# EAGLE schematic nodeTestPanel (EAGLE 9.0.1)

## Sheet 1 of 2
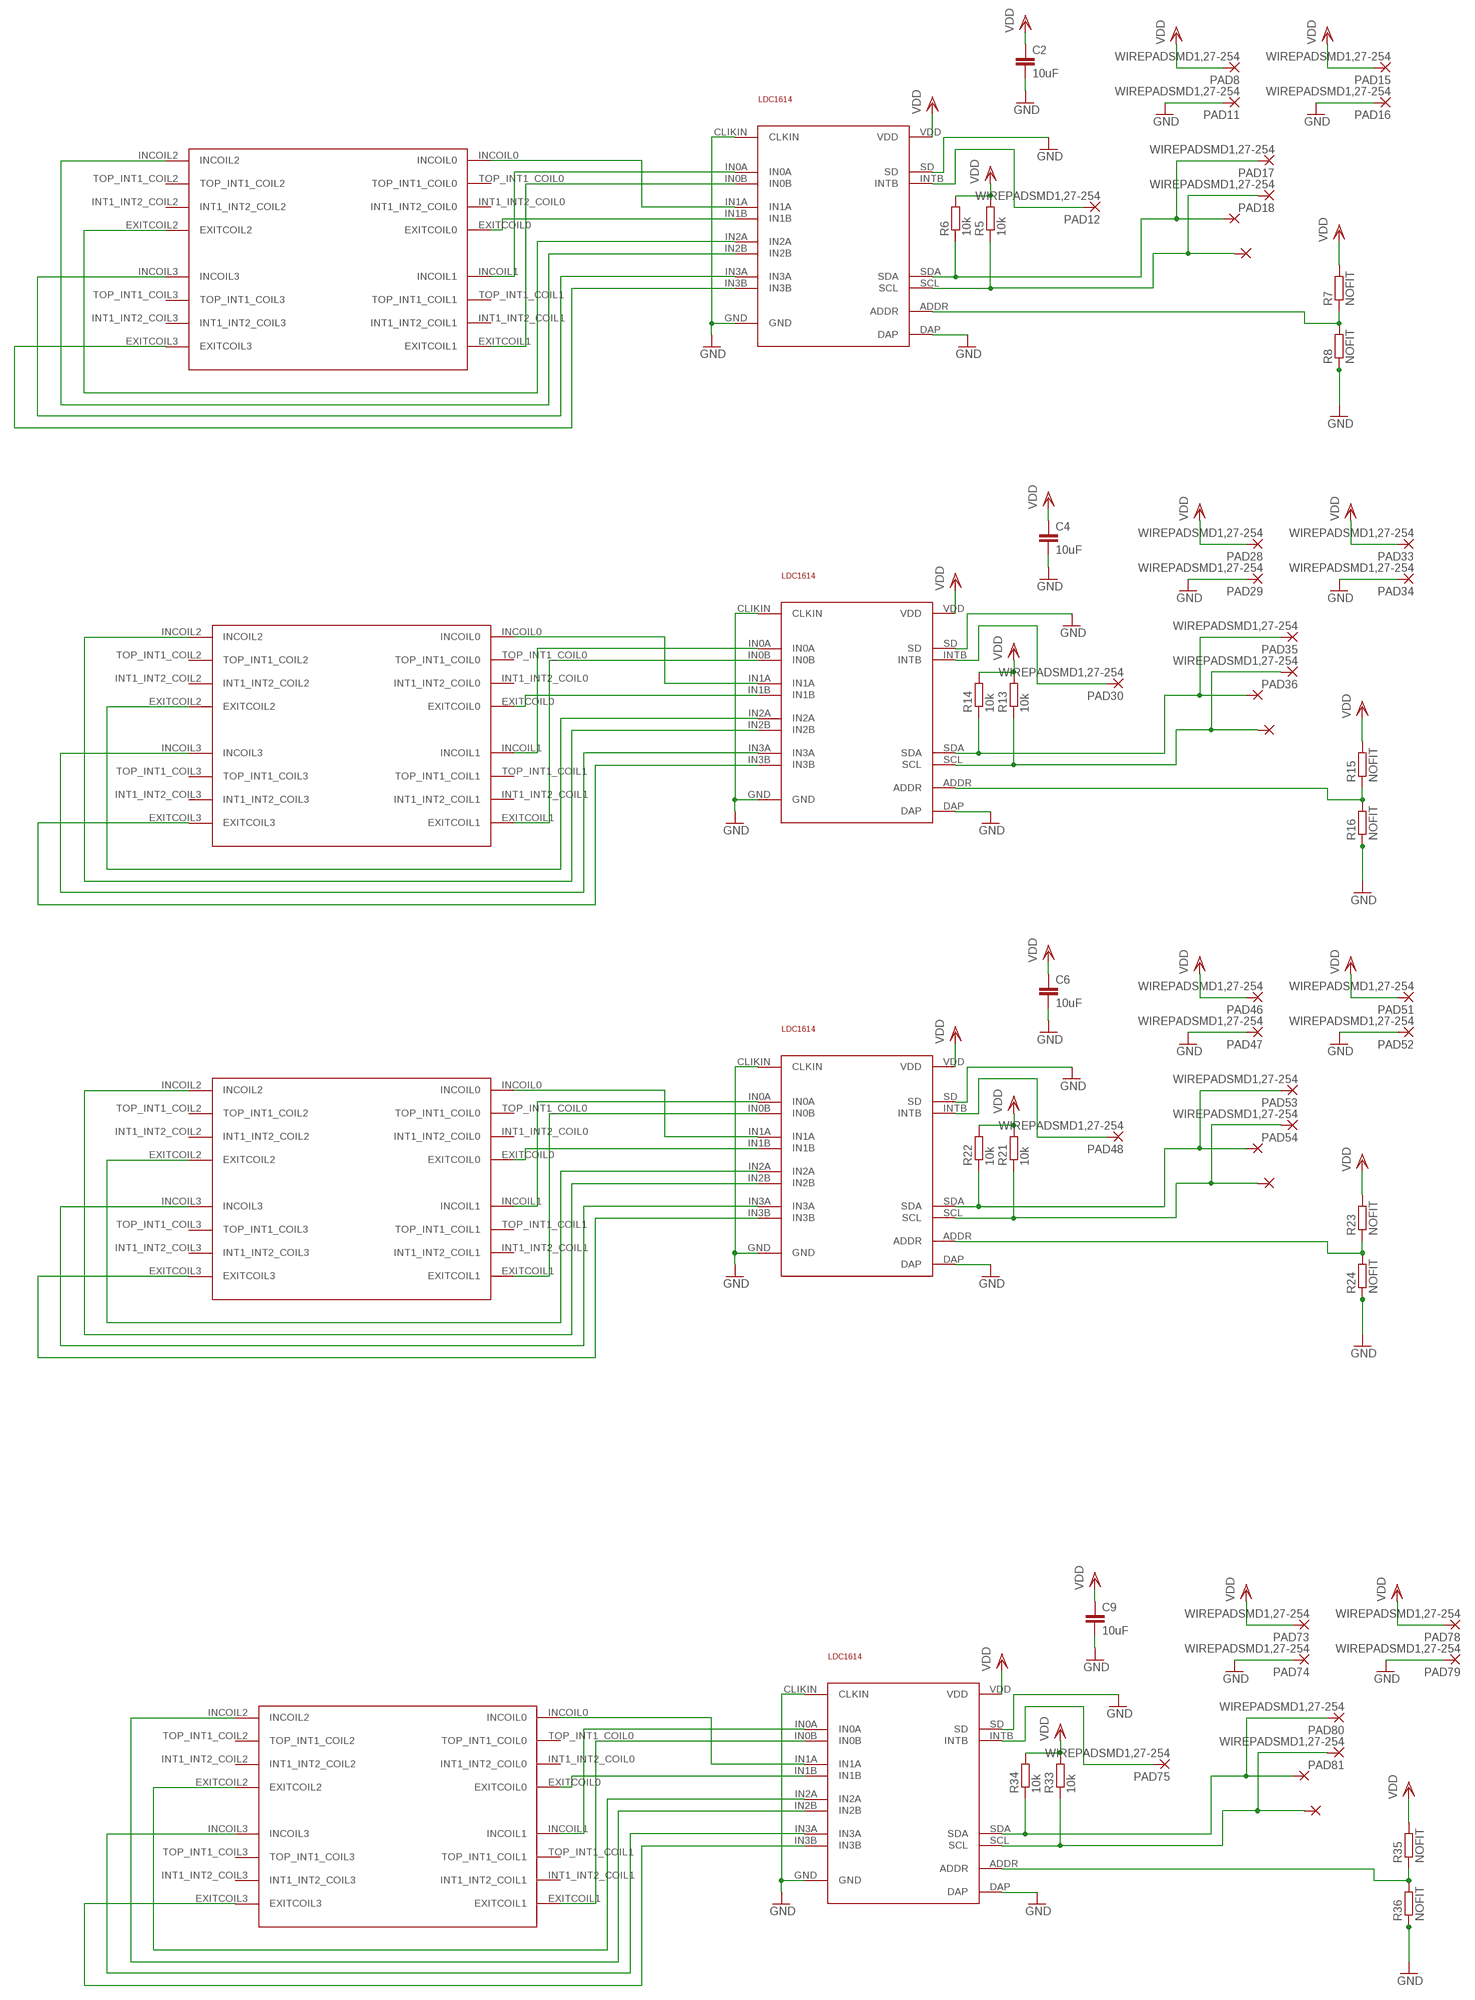
[diagram p0: schematic, sheet 1, part 1 of 3]
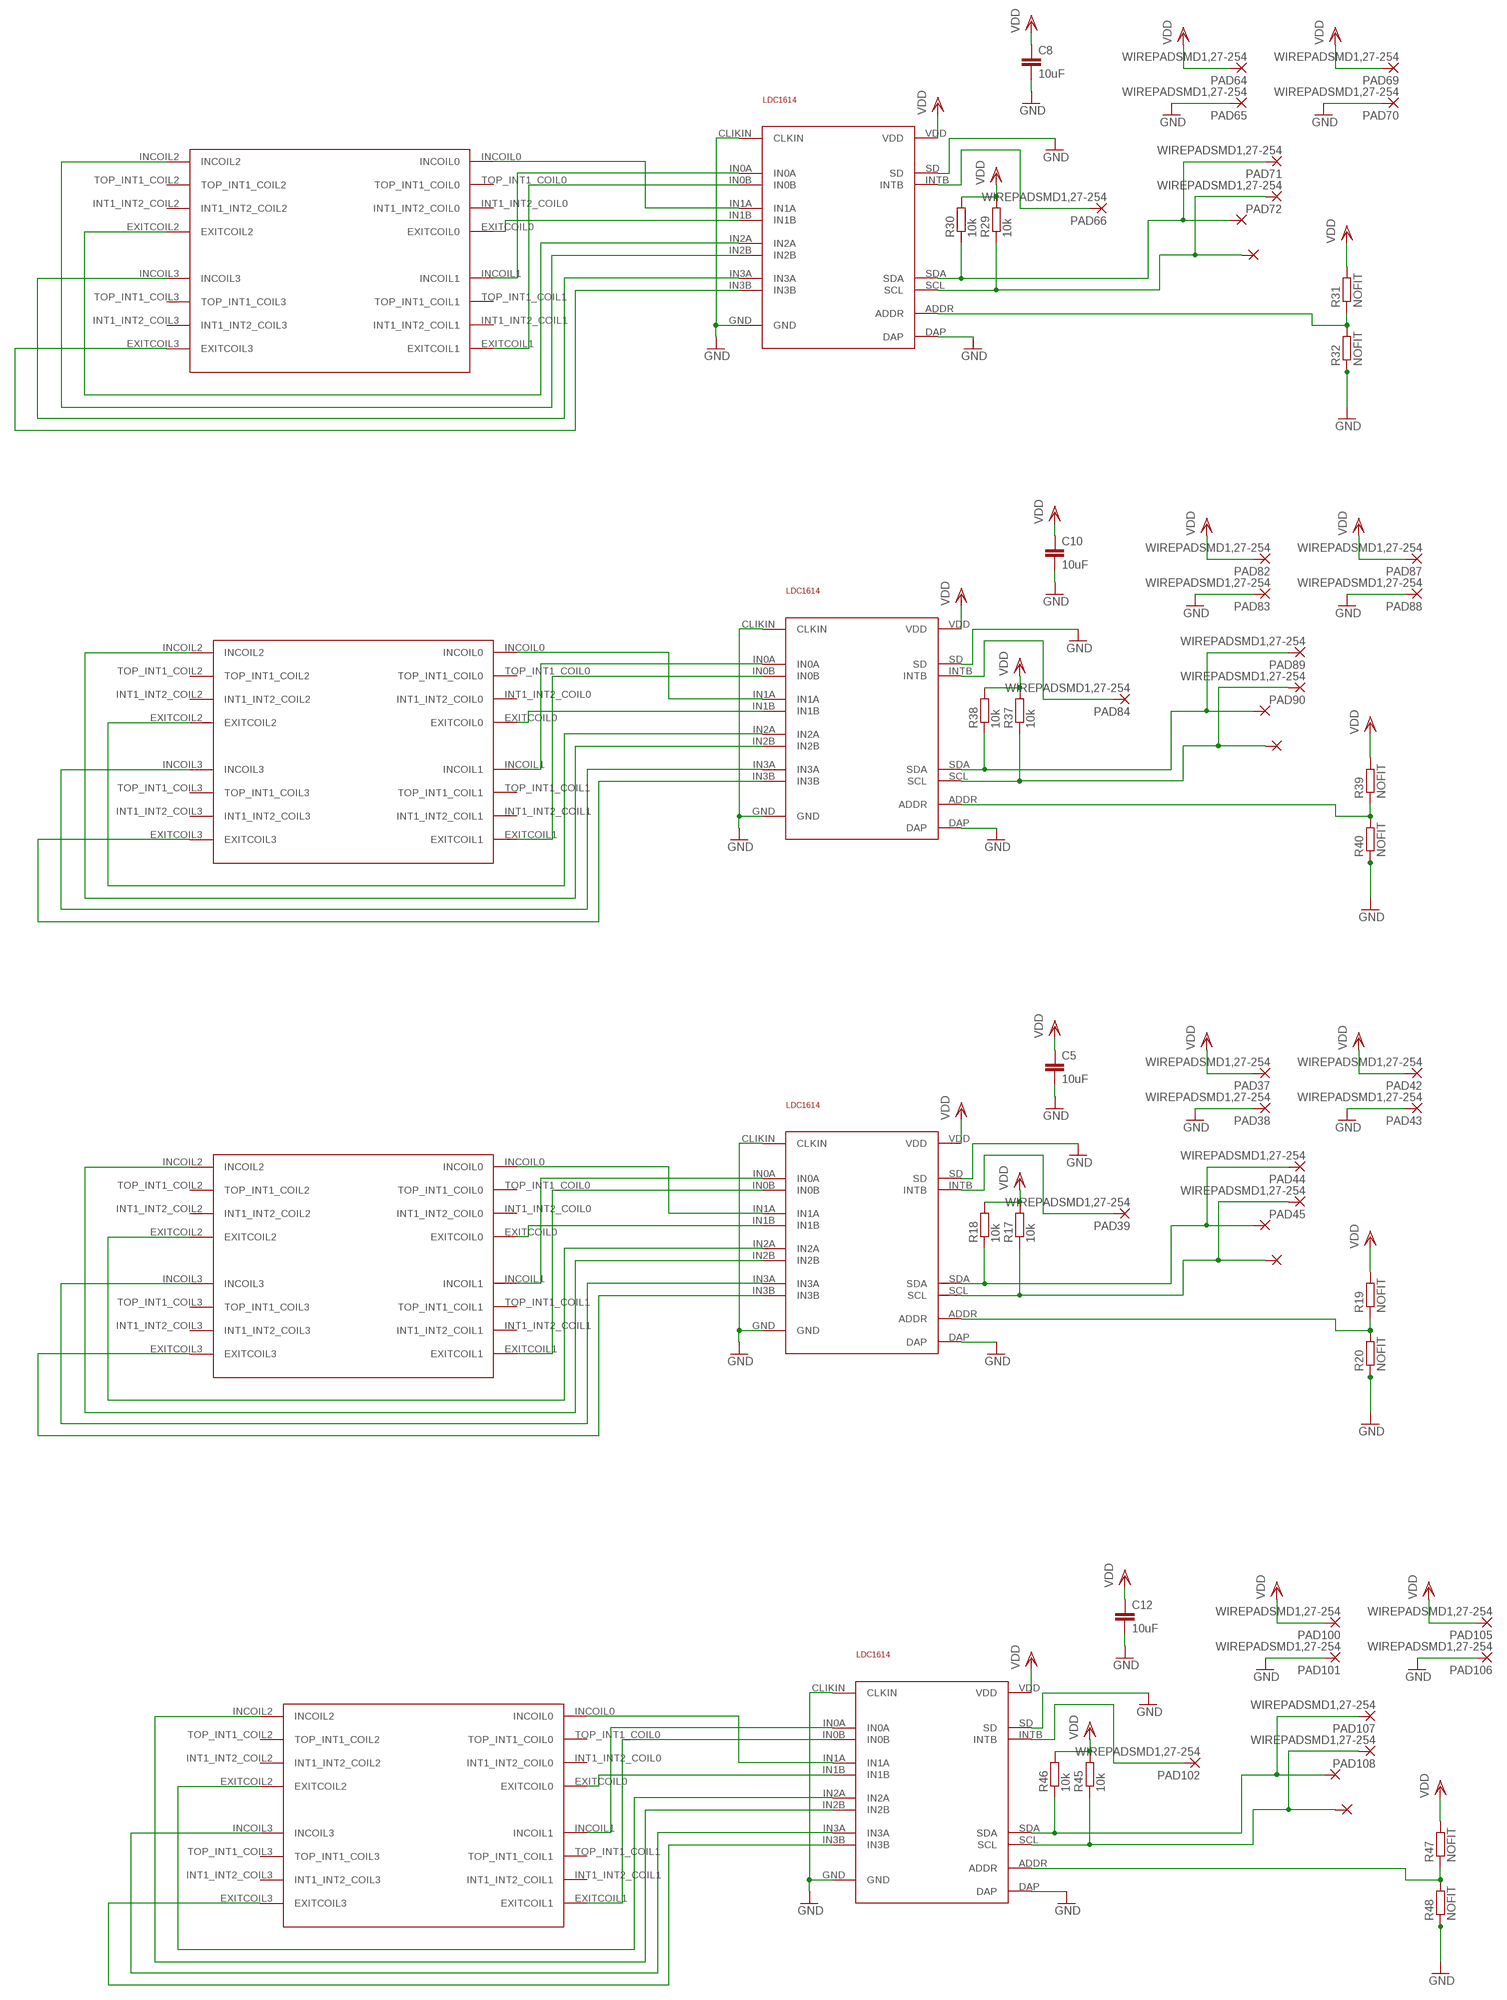
[diagram p1: schematic, sheet 1, part 2 of 3]
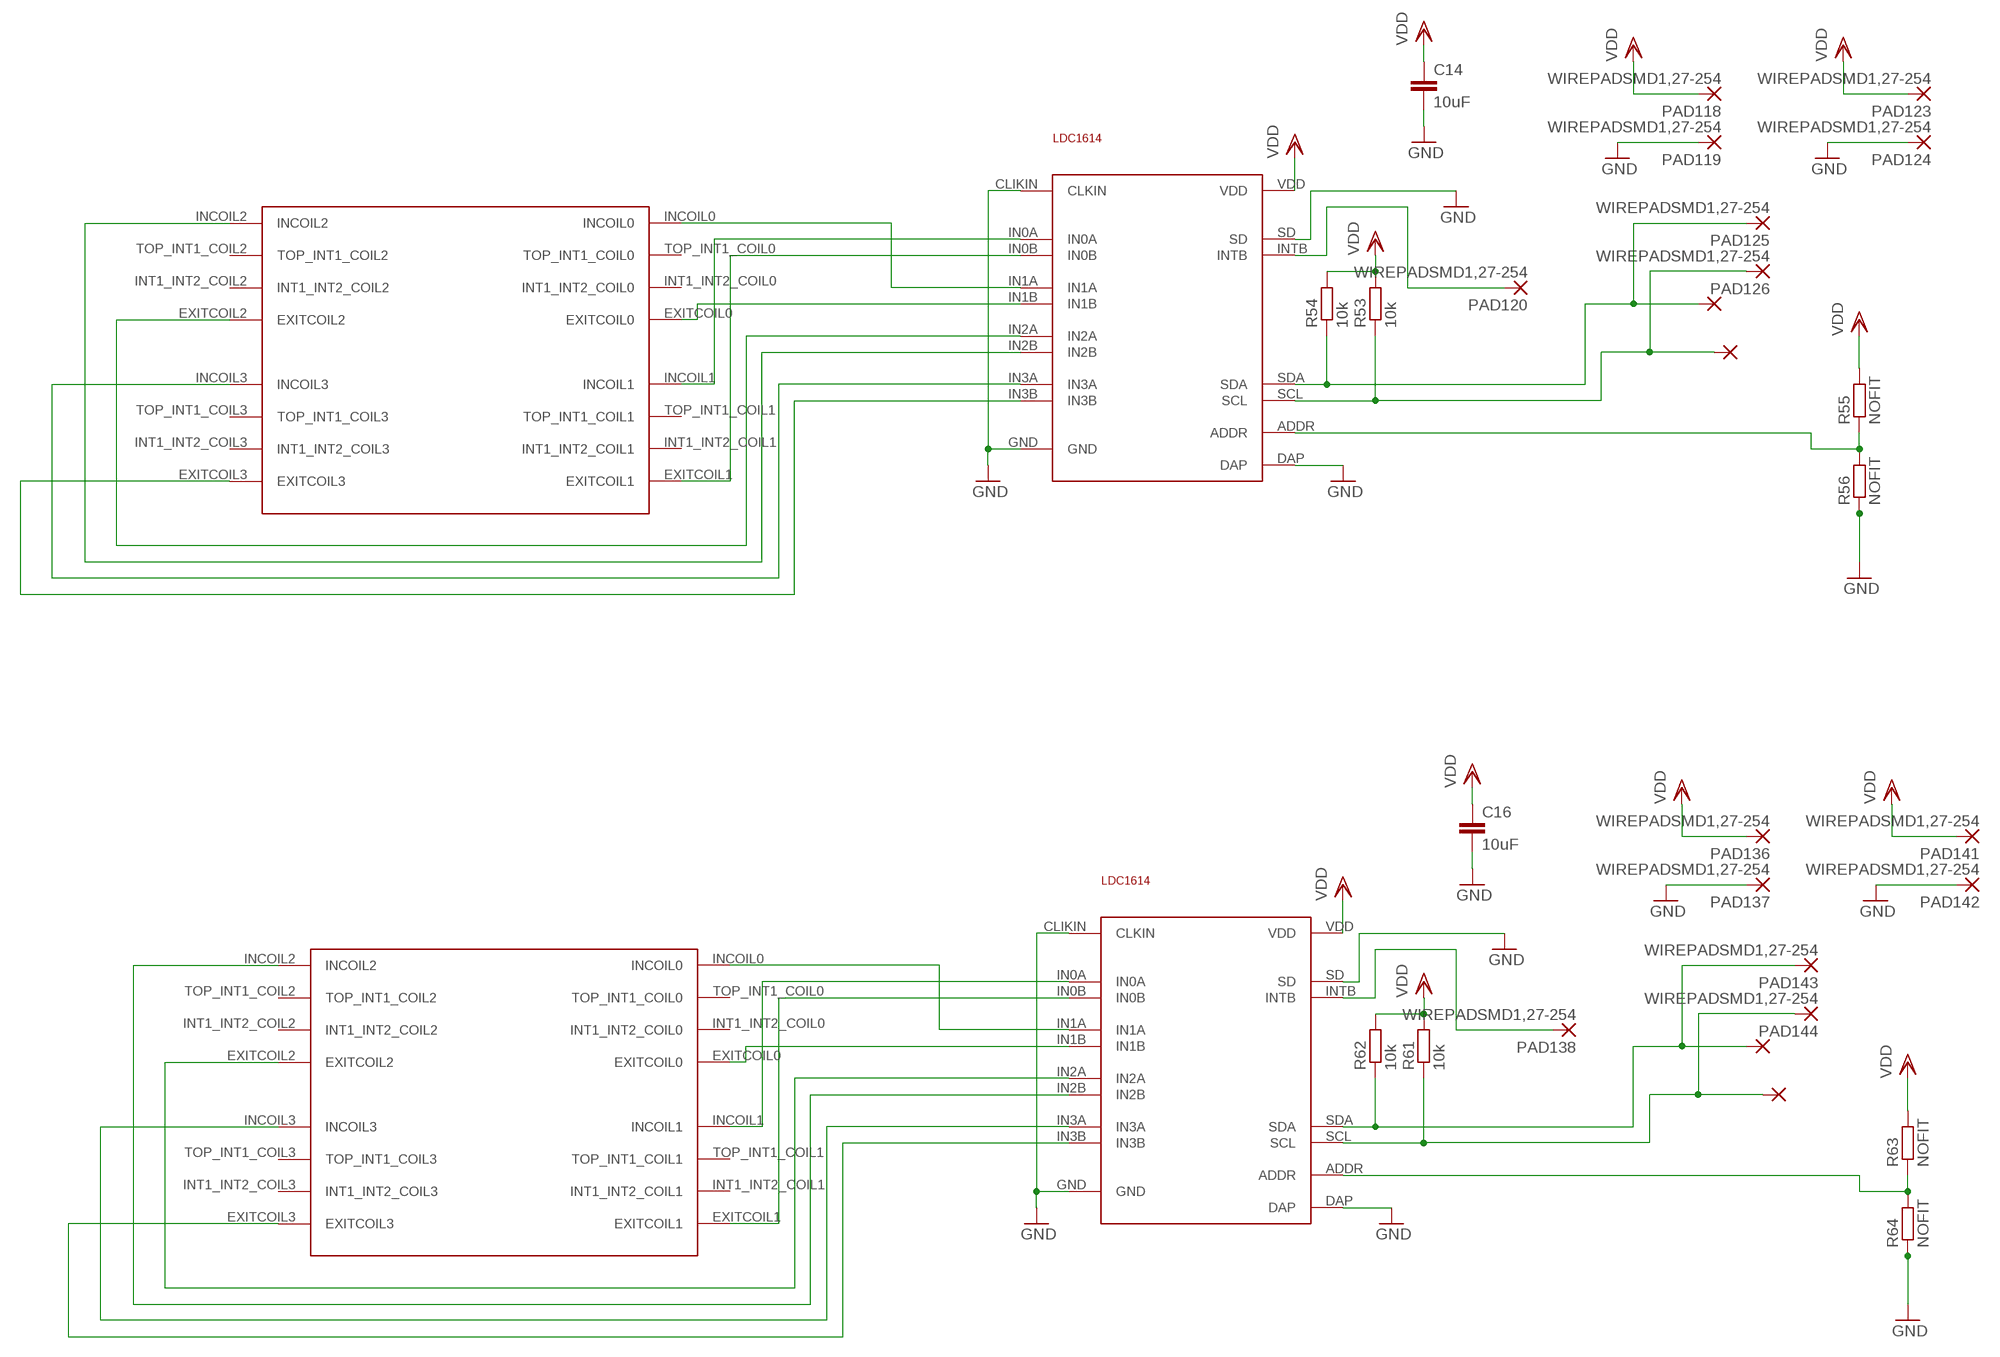
[diagram p2: schematic, sheet 1, part 3 of 3]

### Parts
C2  10uF  C-EUC0402  [C0402]
C4  10uF  C-EUC0402  [C0402]
C5  10uF  C-EUC0402  [C0402]
C6  10uF  C-EUC0402  [C0402]
C8  10uF  C-EUC0402  [C0402]
C9  10uF  C-EUC0402  [C0402]
C10  10uF  C-EUC0402  [C0402]
C12  10uF  C-EUC0402  [C0402]
C14  10uF  C-EUC0402  [C0402]
C16  10uF  C-EUC0402  [C0402]
PAD8  WIREPADSMD1,27-254  [SMD1,27-2,54]
PAD11  WIREPADSMD1,27-254  [SMD1,27-2,54]
PAD12  WIREPADSMD1,27-254  [SMD1,27-2,54]
PAD13  WIREPADSMD1,27-254  [SMD1,27-2,54]
PAD14  WIREPADSMD1,27-254  [SMD1,27-2,54]
PAD15  WIREPADSMD1,27-254  [SMD1,27-2,54]
PAD16  WIREPADSMD1,27-254  [SMD1,27-2,54]
PAD17  WIREPADSMD1,27-254  [SMD1,27-2,54]
PAD18  WIREPADSMD1,27-254  [SMD1,27-2,54]
PAD28  WIREPADSMD1,27-254  [SMD1,27-2,54]
PAD29  WIREPADSMD1,27-254  [SMD1,27-2,54]
PAD30  WIREPADSMD1,27-254  [SMD1,27-2,54]
PAD31  WIREPADSMD1,27-254  [SMD1,27-2,54]
PAD32  WIREPADSMD1,27-254  [SMD1,27-2,54]
PAD33  WIREPADSMD1,27-254  [SMD1,27-2,54]
PAD34  WIREPADSMD1,27-254  [SMD1,27-2,54]
PAD35  WIREPADSMD1,27-254  [SMD1,27-2,54]
PAD36  WIREPADSMD1,27-254  [SMD1,27-2,54]
PAD37  WIREPADSMD1,27-254  [SMD1,27-2,54]
PAD38  WIREPADSMD1,27-254  [SMD1,27-2,54]
PAD39  WIREPADSMD1,27-254  [SMD1,27-2,54]
PAD40  WIREPADSMD1,27-254  [SMD1,27-2,54]
PAD41  WIREPADSMD1,27-254  [SMD1,27-2,54]
PAD42  WIREPADSMD1,27-254  [SMD1,27-2,54]
PAD43  WIREPADSMD1,27-254  [SMD1,27-2,54]
PAD44  WIREPADSMD1,27-254  [SMD1,27-2,54]
PAD45  WIREPADSMD1,27-254  [SMD1,27-2,54]
PAD46  WIREPADSMD1,27-254  [SMD1,27-2,54]
PAD47  WIREPADSMD1,27-254  [SMD1,27-2,54]
PAD48  WIREPADSMD1,27-254  [SMD1,27-2,54]
PAD49  WIREPADSMD1,27-254  [SMD1,27-2,54]
PAD50  WIREPADSMD1,27-254  [SMD1,27-2,54]
PAD51  WIREPADSMD1,27-254  [SMD1,27-2,54]
PAD52  WIREPADSMD1,27-254  [SMD1,27-2,54]
PAD53  WIREPADSMD1,27-254  [SMD1,27-2,54]
PAD54  WIREPADSMD1,27-254  [SMD1,27-2,54]
PAD64  WIREPADSMD1,27-254  [SMD1,27-2,54]
PAD65  WIREPADSMD1,27-254  [SMD1,27-2,54]
PAD66  WIREPADSMD1,27-254  [SMD1,27-2,54]
PAD67  WIREPADSMD1,27-254  [SMD1,27-2,54]
PAD68  WIREPADSMD1,27-254  [SMD1,27-2,54]
PAD69  WIREPADSMD1,27-254  [SMD1,27-2,54]
PAD70  WIREPADSMD1,27-254  [SMD1,27-2,54]
PAD71  WIREPADSMD1,27-254  [SMD1,27-2,54]
PAD72  WIREPADSMD1,27-254  [SMD1,27-2,54]
PAD73  WIREPADSMD1,27-254  [SMD1,27-2,54]
PAD74  WIREPADSMD1,27-254  [SMD1,27-2,54]
PAD75  WIREPADSMD1,27-254  [SMD1,27-2,54]
PAD76  WIREPADSMD1,27-254  [SMD1,27-2,54]
PAD77  WIREPADSMD1,27-254  [SMD1,27-2,54]
PAD78  WIREPADSMD1,27-254  [SMD1,27-2,54]
PAD79  WIREPADSMD1,27-254  [SMD1,27-2,54]
PAD80  WIREPADSMD1,27-254  [SMD1,27-2,54]
PAD81  WIREPADSMD1,27-254  [SMD1,27-2,54]
PAD82  WIREPADSMD1,27-254  [SMD1,27-2,54]
PAD83  WIREPADSMD1,27-254  [SMD1,27-2,54]
PAD84  WIREPADSMD1,27-254  [SMD1,27-2,54]
PAD85  WIREPADSMD1,27-254  [SMD1,27-2,54]
PAD86  WIREPADSMD1,27-254  [SMD1,27-2,54]
PAD87  WIREPADSMD1,27-254  [SMD1,27-2,54]
PAD88  WIREPADSMD1,27-254  [SMD1,27-2,54]
PAD89  WIREPADSMD1,27-254  [SMD1,27-2,54]
PAD90  WIREPADSMD1,27-254  [SMD1,27-2,54]
PAD100  WIREPADSMD1,27-254  [SMD1,27-2,54]
PAD101  WIREPADSMD1,27-254  [SMD1,27-2,54]
PAD102  WIREPADSMD1,27-254  [SMD1,27-2,54]
PAD103  WIREPADSMD1,27-254  [SMD1,27-2,54]
PAD104  WIREPADSMD1,27-254  [SMD1,27-2,54]
PAD105  WIREPADSMD1,27-254  [SMD1,27-2,54]
PAD106  WIREPADSMD1,27-254  [SMD1,27-2,54]
PAD107  WIREPADSMD1,27-254  [SMD1,27-2,54]
PAD108  WIREPADSMD1,27-254  [SMD1,27-2,54]
PAD118  WIREPADSMD1,27-254  [SMD1,27-2,54]
PAD119  WIREPADSMD1,27-254  [SMD1,27-2,54]
PAD120  WIREPADSMD1,27-254  [SMD1,27-2,54]
PAD121  WIREPADSMD1,27-254  [SMD1,27-2,54]
PAD122  WIREPADSMD1,27-254  [SMD1,27-2,54]
PAD123  WIREPADSMD1,27-254  [SMD1,27-2,54]
PAD124  WIREPADSMD1,27-254  [SMD1,27-2,54]
PAD125  WIREPADSMD1,27-254  [SMD1,27-2,54]
PAD126  WIREPADSMD1,27-254  [SMD1,27-2,54]
PAD136  WIREPADSMD1,27-254  [SMD1,27-2,54]
PAD137  WIREPADSMD1,27-254  [SMD1,27-2,54]
PAD138  WIREPADSMD1,27-254  [SMD1,27-2,54]
PAD139  WIREPADSMD1,27-254  [SMD1,27-2,54]
PAD140  WIREPADSMD1,27-254  [SMD1,27-2,54]
PAD141  WIREPADSMD1,27-254  [SMD1,27-2,54]
PAD142  WIREPADSMD1,27-254  [SMD1,27-2,54]
PAD143  WIREPADSMD1,27-254  [SMD1,27-2,54]
PAD144  WIREPADSMD1,27-254  [SMD1,27-2,54]
R5  10k  R-EU_R0402  [R0402]
R6  10k  R-EU_R0402  [R0402]
R7  NOFIT  R-EU_R0201  [R0201]
R8  NOFIT  R-EU_R0201  [R0201]
R13  10k  R-EU_R0402  [R0402]
R14  10k  R-EU_R0402  [R0402]
R15  NOFIT  R-EU_R0201  [R0201]
R16  NOFIT  R-EU_R0201  [R0201]
R17  10k  R-EU_R0402  [R0402]
R18  10k  R-EU_R0402  [R0402]
R19  NOFIT  R-EU_R0201  [R0201]
R20  NOFIT  R-EU_R0201  [R0201]
R21  10k  R-EU_R0402  [R0402]
R22  10k  R-EU_R0402  [R0402]
R23  NOFIT  R-EU_R0201  [R0201]
R24  NOFIT  R-EU_R0201  [R0201]
R29  10k  R-EU_R0402  [R0402]
R30  10k  R-EU_R0402  [R0402]
R31  NOFIT  R-EU_R0201  [R0201]
R32  NOFIT  R-EU_R0201  [R0201]
R33  10k  R-EU_R0402  [R0402]
R34  10k  R-EU_R0402  [R0402]
R35  NOFIT  R-EU_R0201  [R0201]
R36  NOFIT  R-EU_R0201  [R0201]
R37  10k  R-EU_R0402  [R0402]
R38  10k  R-EU_R0402  [R0402]
R39  NOFIT  R-EU_R0201  [R0201]
R40  NOFIT  R-EU_R0201  [R0201]
R45  10k  R-EU_R0402  [R0402]
R46  10k  R-EU_R0402  [R0402]
R47  NOFIT  R-EU_R0201  [R0201]
R48  NOFIT  R-EU_R0201  [R0201]
R53  10k  R-EU_R0402  [R0402]
R54  10k  R-EU_R0402  [R0402]
R55  NOFIT  R-EU_R0201  [R0201]
R56  NOFIT  R-EU_R0201  [R0201]
R61  10k  R-EU_R0402  [R0402]
R62  10k  R-EU_R0402  [R0402]
R63  NOFIT  R-EU_R0201  [R0201]
R64  NOFIT  R-EU_R0201  [R0201]
U2  LDC1614  [WQFN-16]
U4  LDC1614  [WQFN-16]
U5  LDC1614  [WQFN-16]
U6  LDC1614  [WQFN-16]
U8  LDC1614  [WQFN-16]
U9  LDC1614  [WQFN-16]
U10  LDC1614  [WQFN-16]
U12  LDC1614  [WQFN-16]
U14  LDC1614  [WQFN-16]
U16  LDC1614  [WQFN-16]
U$1  FATSQUARE_GROUP  [FAT_SQUARE]
U$4  FATSQUARE_GROUP  [FAT_SQUARE]
U$5  FATSQUARE_GROUP  [FAT_SQUARE]
U$6  FATSQUARE_GROUP  [FAT_SQUARE]
U$8  FATSQUARE_GROUP  [FAT_SQUARE]
U$9  FATSQUARE_GROUP  [FAT_SQUARE]
U$10  FATSQUARE_GROUP  [FAT_SQUARE]
U$12  FATSQUARE_GROUP  [FAT_SQUARE]
U$14  FATSQUARE_GROUP  [FAT_SQUARE]
U$16  FATSQUARE_GROUP  [FAT_SQUARE]

### Nets
ADDR1: R7.1 R8.2 U2.ADDR
ADDR3: R15.1 R16.2 U4.ADDR
ADDR4: R19.1 R20.2 U5.ADDR
ADDR5: R23.1 R24.2 U6.ADDR
ADDR7: R31.1 R32.2 U8.ADDR
ADDR8: R35.1 R36.2 U9.ADDR
ADDR9: R39.1 R40.2 U10.ADDR
ADDR11: R47.1 R48.2 U12.ADDR
ADDR13: R55.1 R56.2 U14.ADDR
ADDR15: R63.1 R64.2 U16.ADDR
GND: C2.2 C4.2 C5.2 C6.2 C8.2 C9.2 C10.2 C12.2 C14.2 C16.2 PAD11.1(P) PAD16.1(P) PAD29.1(P) PAD34.1(P) PAD38.1(P) PAD43.1(P) PAD47.1(P) PAD52.1(P) PAD65.1(P) PAD70.1(P) PAD74.1(P) PAD79.1(P) PAD83.1(P) PAD88.1(P) PAD101.1(P) PAD106.1(P) PAD119.1(P) PAD124.1(P) PAD137.1(P) PAD142.1(P) R8.1 R16.1 R20.1 R24.1 R32.1 R36.1 R40.1 R48.1 R56.1 R64.1 U2.CLIKIN(CLKIN) U2.DAP U2.GND U2.SD U4.CLIKIN(CLKIN) U4.DAP U4.GND U4.SD U5.CLIKIN(CLKIN) U5.DAP U5.GND U5.SD U6.CLIKIN(CLKIN) U6.DAP U6.GND U6.SD U8.CLIKIN(CLKIN) U8.DAP U8.GND U8.SD U9.CLIKIN(CLKIN) U9.DAP U9.GND U9.SD U10.CLIKIN(CLKIN) U10.DAP U10.GND U10.SD U12.CLIKIN(CLKIN) U12.DAP U12.GND U12.SD U14.CLIKIN(CLKIN) U14.DAP U14.GND U14.SD U16.CLIKIN(CLKIN) U16.DAP U16.GND U16.SD ; also sheet 2
INTRPT1: PAD12.1(P) U2.INTB
INTRPT3: PAD30.1(P) U4.INTB
INTRPT4: PAD39.1(P) U5.INTB
INTRPT5: PAD48.1(P) U6.INTB
INTRPT7: PAD66.1(P) U8.INTB
INTRPT8: PAD75.1(P) U9.INTB
INTRPT9: PAD84.1(P) U10.INTB
INTRPT11: PAD102.1(P) U12.INTB
INTRPT13: PAD120.1(P) U14.INTB
INTRPT15: PAD138.1(P) U16.INTB
N$1: U2.IN1B U$1.EXITCOIL0
N$2: U2.IN0A U$1.INCOIL1
N$3: U2.IN0B U$1.EXITCOIL1
N$4: U2.IN2A U$1.EXITCOIL2
N$5: U2.IN2B U$1.INCOIL2
N$14: U2.IN3A U$1.INCOIL3
N$15: U2.IN3B U$1.EXITCOIL3
N$16: U2.IN1A U$1.INCOIL0
N$25: U4.IN1B U$4.EXITCOIL0
N$26: U4.IN0A U$4.INCOIL1
N$27: U4.IN0B U$4.EXITCOIL1
N$28: U4.IN2A U$4.EXITCOIL2
N$29: U4.IN2B U$4.INCOIL2
N$30: U4.IN3A U$4.INCOIL3
N$31: U4.IN3B U$4.EXITCOIL3
N$32: U4.IN1A U$4.INCOIL0
N$33: U5.IN1B U$5.EXITCOIL0
N$34: U5.IN0A U$5.INCOIL1
N$35: U5.IN0B U$5.EXITCOIL1
N$36: U5.IN2A U$5.EXITCOIL2
N$37: U5.IN2B U$5.INCOIL2
N$38: U5.IN3A U$5.INCOIL3
N$39: U5.IN3B U$5.EXITCOIL3
N$40: U5.IN1A U$5.INCOIL0
N$41: U6.IN1B U$6.EXITCOIL0
N$42: U6.IN0A U$6.INCOIL1
N$43: U6.IN0B U$6.EXITCOIL1
N$44: U6.IN2A U$6.EXITCOIL2
N$45: U6.IN2B U$6.INCOIL2
N$46: U6.IN3A U$6.INCOIL3
N$47: U6.IN3B U$6.EXITCOIL3
N$48: U6.IN1A U$6.INCOIL0
N$57: U8.IN1B U$8.EXITCOIL0
N$58: U8.IN0A U$8.INCOIL1
N$59: U8.IN0B U$8.EXITCOIL1
N$60: U8.IN2A U$8.EXITCOIL2
N$61: U8.IN2B U$8.INCOIL2
N$62: U8.IN3A U$8.INCOIL3
N$63: U8.IN3B U$8.EXITCOIL3
N$64: U8.IN1A U$8.INCOIL0
N$65: U9.IN1B U$9.EXITCOIL0
N$66: U9.IN0A U$9.INCOIL1
N$67: U9.IN0B U$9.EXITCOIL1
N$68: U9.IN2A U$9.EXITCOIL2
N$69: U9.IN2B U$9.INCOIL2
N$70: U9.IN3A U$9.INCOIL3
N$71: U9.IN3B U$9.EXITCOIL3
N$72: U9.IN1A U$9.INCOIL0
N$73: U10.IN1B U$10.EXITCOIL0
N$74: U10.IN0A U$10.INCOIL1
N$75: U10.IN0B U$10.EXITCOIL1
N$76: U10.IN2A U$10.EXITCOIL2
N$77: U10.IN2B U$10.INCOIL2
N$78: U10.IN3A U$10.INCOIL3
N$79: U10.IN3B U$10.EXITCOIL3
N$80: U10.IN1A U$10.INCOIL0
N$89: U12.IN1B U$12.EXITCOIL0
N$90: U12.IN0A U$12.INCOIL1
N$91: U12.IN0B U$12.EXITCOIL1
N$92: U12.IN2A U$12.EXITCOIL2
N$93: U12.IN2B U$12.INCOIL2
N$94: U12.IN3A U$12.INCOIL3
N$95: U12.IN3B U$12.EXITCOIL3
N$96: U12.IN1A U$12.INCOIL0
N$105: U14.IN1B U$14.EXITCOIL0
N$106: U14.IN0A U$14.INCOIL1
N$107: U14.IN0B U$14.EXITCOIL1
N$108: U14.IN2A U$14.EXITCOIL2
N$109: U14.IN2B U$14.INCOIL2
N$110: U14.IN3A U$14.INCOIL3
N$111: U14.IN3B U$14.EXITCOIL3
N$112: U14.IN1A U$14.INCOIL0
N$121: U16.IN1B U$16.EXITCOIL0
N$122: U16.IN0A U$16.INCOIL1
N$123: U16.IN0B U$16.EXITCOIL1
N$124: U16.IN2A U$16.EXITCOIL2
N$125: U16.IN2B U$16.INCOIL2
N$126: U16.IN3A U$16.INCOIL3
N$127: U16.IN3B U$16.EXITCOIL3
N$128: U16.IN1A U$16.INCOIL0
SCL1: PAD14.1(P) PAD18.1(P) R5.1 U2.SCL
SCL3: PAD32.1(P) PAD36.1(P) R13.1 U4.SCL
SCL4: PAD41.1(P) PAD45.1(P) R17.1 U5.SCL
SCL5: PAD50.1(P) PAD54.1(P) R21.1 U6.SCL
SCL7: PAD68.1(P) PAD72.1(P) R29.1 U8.SCL
SCL8: PAD77.1(P) PAD81.1(P) R33.1 U9.SCL
SCL9: PAD86.1(P) PAD90.1(P) R37.1 U10.SCL
SCL11: PAD104.1(P) PAD108.1(P) R45.1 U12.SCL
SCL13: PAD122.1(P) PAD126.1(P) R53.1 U14.SCL
SCL15: PAD140.1(P) PAD144.1(P) R61.1 U16.SCL
SDA1: PAD13.1(P) PAD17.1(P) R6.1 U2.SDA
SDA3: PAD31.1(P) PAD35.1(P) R14.1 U4.SDA
SDA4: PAD40.1(P) PAD44.1(P) R18.1 U5.SDA
SDA5: PAD49.1(P) PAD53.1(P) R22.1 U6.SDA
SDA7: PAD67.1(P) PAD71.1(P) R30.1 U8.SDA
SDA8: PAD76.1(P) PAD80.1(P) R34.1 U9.SDA
SDA9: PAD85.1(P) PAD89.1(P) R38.1 U10.SDA
SDA11: PAD103.1(P) PAD107.1(P) R46.1 U12.SDA
SDA13: PAD121.1(P) PAD125.1(P) R54.1 U14.SDA
SDA15: PAD139.1(P) PAD143.1(P) R62.1 U16.SDA
VDD: C2.1 C4.1 C5.1 C6.1 C8.1 C9.1 C10.1 C12.1 C14.1 C16.1 PAD8.1(P) PAD15.1(P) PAD28.1(P) PAD33.1(P) PAD37.1(P) PAD42.1(P) PAD46.1(P) PAD51.1(P) PAD64.1(P) PAD69.1(P) PAD73.1(P) PAD78.1(P) PAD82.1(P) PAD87.1(P) PAD100.1(P) PAD105.1(P) PAD118.1(P) PAD123.1(P) PAD136.1(P) PAD141.1(P) R5.2 R6.2 R7.2 R13.2 R14.2 R15.2 R17.2 R18.2 R19.2 R21.2 R22.2 R23.2 R29.2 R30.2 R31.2 R33.2 R34.2 R35.2 R37.2 R38.2 R39.2 R45.2 R46.2 R47.2 R53.2 R54.2 R55.2 R61.2 R62.2 R63.2 U2.VDD U4.VDD U5.VDD U6.VDD U8.VDD U9.VDD U10.VDD U12.VDD U14.VDD U16.VDD ; also sheet 2
Unconnected: U$1.INT1_INT2_COIL0 U$1.INT1_INT2_COIL1 U$1.INT1_INT2_COIL2 U$1.INT1_INT2_COIL3 U$1.TOP_INT1_COIL0 U$1.TOP_INT1_COIL1 U$1.TOP_INT1_COIL2 U$1.TOP_INT1_COIL3 U$4.INT1_INT2_COIL0 U$4.INT1_INT2_COIL1 U$4.INT1_INT2_COIL2 U$4.INT1_INT2_COIL3 U$4.TOP_INT1_COIL0 U$4.TOP_INT1_COIL1 U$4.TOP_INT1_COIL2 U$4.TOP_INT1_COIL3 U$5.INT1_INT2_COIL0 U$5.INT1_INT2_COIL1 U$5.INT1_INT2_COIL2 U$5.INT1_INT2_COIL3 U$5.TOP_INT1_COIL0 U$5.TOP_INT1_COIL1 U$5.TOP_INT1_COIL2 U$5.TOP_INT1_COIL3 U$6.INT1_INT2_COIL0 U$6.INT1_INT2_COIL1 U$6.INT1_INT2_COIL2 U$6.INT1_INT2_COIL3 U$6.TOP_INT1_COIL0 U$6.TOP_INT1_COIL1 U$6.TOP_INT1_COIL2 U$6.TOP_INT1_COIL3 U$8.INT1_INT2_COIL0 U$8.INT1_INT2_COIL1 U$8.INT1_INT2_COIL2 U$8.INT1_INT2_COIL3 U$8.TOP_INT1_COIL0 U$8.TOP_INT1_COIL1 U$8.TOP_INT1_COIL2 U$8.TOP_INT1_COIL3 U$9.INT1_INT2_COIL0 U$9.INT1_INT2_COIL1 U$9.INT1_INT2_COIL2 U$9.INT1_INT2_COIL3 U$9.TOP_INT1_COIL0 U$9.TOP_INT1_COIL1 U$9.TOP_INT1_COIL2 U$9.TOP_INT1_COIL3 U$10.INT1_INT2_COIL0 U$10.INT1_INT2_COIL1 U$10.INT1_INT2_COIL2 U$10.INT1_INT2_COIL3 U$10.TOP_INT1_COIL0 U$10.TOP_INT1_COIL1 U$10.TOP_INT1_COIL2 U$10.TOP_INT1_COIL3 U$12.INT1_INT2_COIL0 U$12.INT1_INT2_COIL1 U$12.INT1_INT2_COIL2 U$12.INT1_INT2_COIL3 U$12.TOP_INT1_COIL0 U$12.TOP_INT1_COIL1 U$12.TOP_INT1_COIL2 U$12.TOP_INT1_COIL3 U$14.INT1_INT2_COIL0 U$14.INT1_INT2_COIL1 U$14.INT1_INT2_COIL2 U$14.INT1_INT2_COIL3 U$14.TOP_INT1_COIL0 U$14.TOP_INT1_COIL1 U$14.TOP_INT1_COIL2 U$14.TOP_INT1_COIL3 U$16.INT1_INT2_COIL0 U$16.INT1_INT2_COIL1 U$16.INT1_INT2_COIL2 U$16.INT1_INT2_COIL3 U$16.TOP_INT1_COIL0 U$16.TOP_INT1_COIL1 U$16.TOP_INT1_COIL2 U$16.TOP_INT1_COIL3

## Sheet 2 of 2
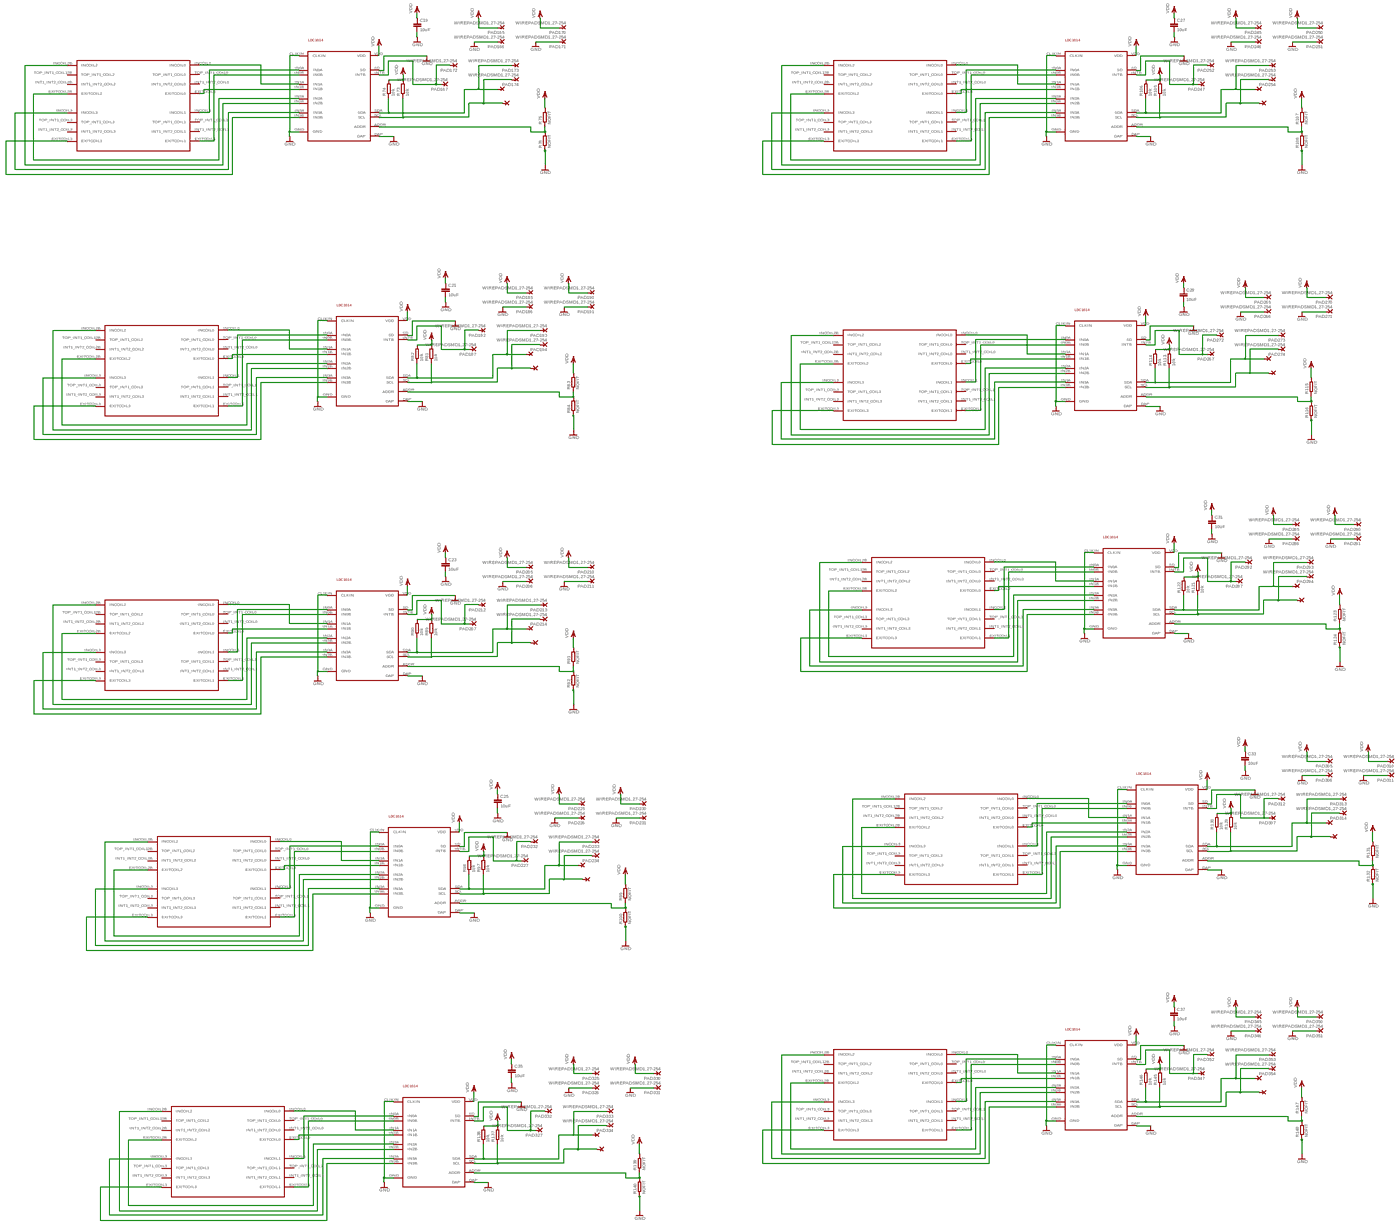
[diagram p3: schematic, sheet 2, overview]
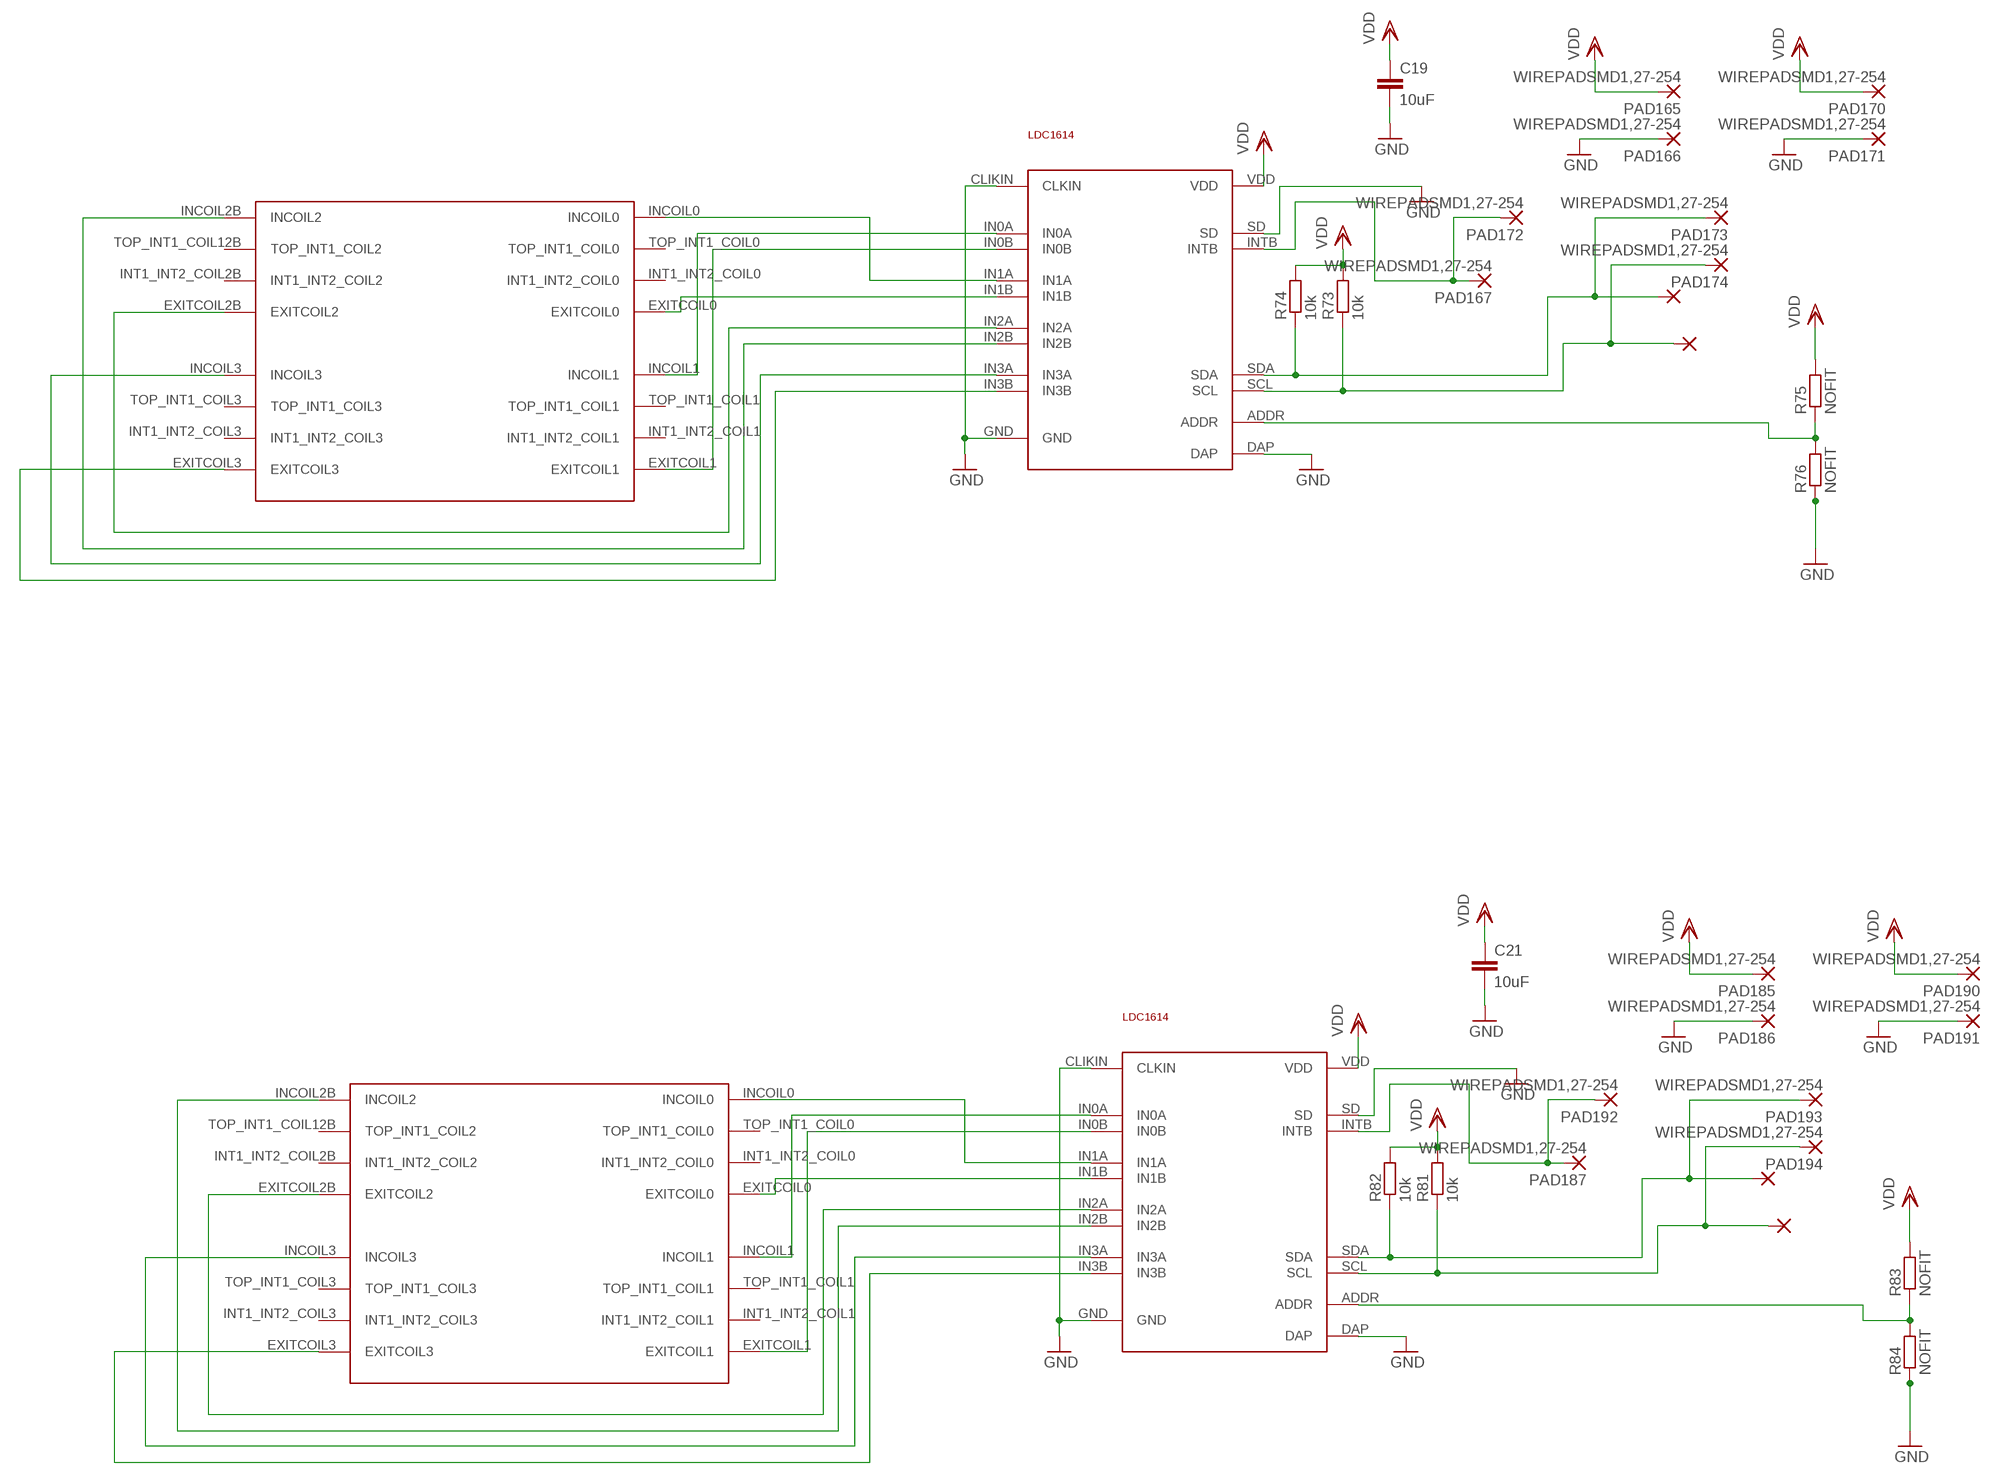
[diagram p4: schematic, sheet 2, part 1 of 4]
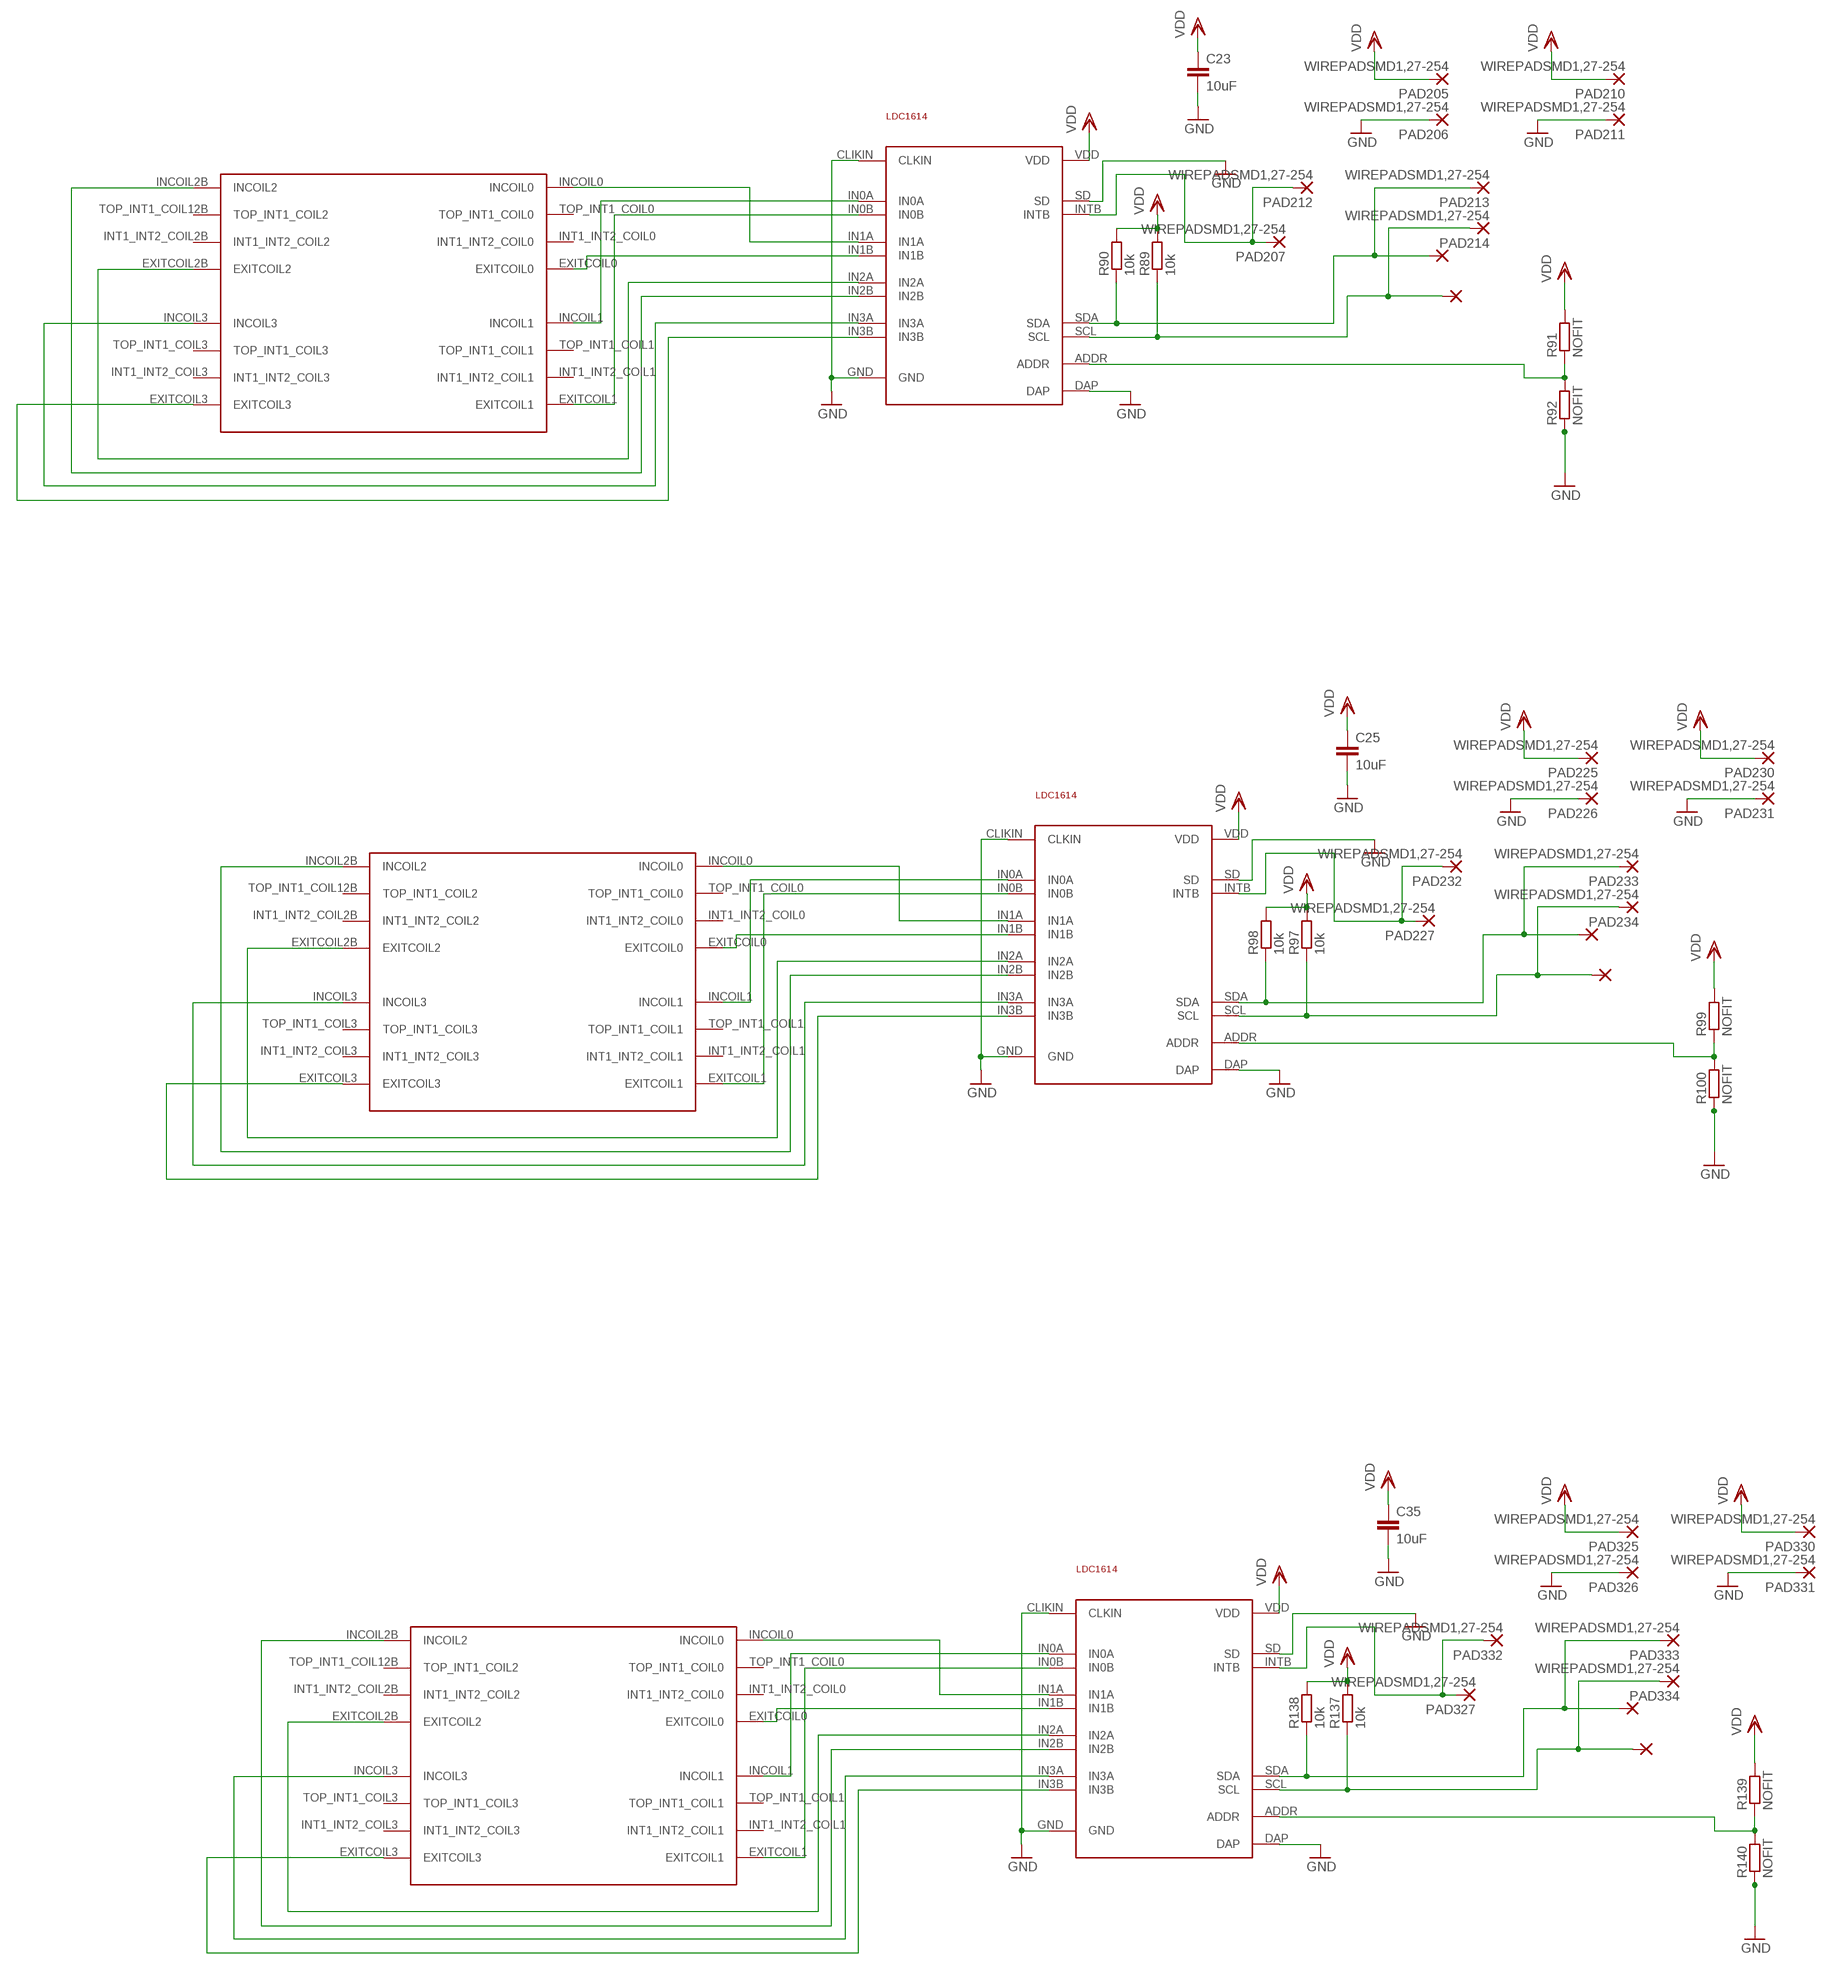
[diagram p5: schematic, sheet 2, part 2 of 4]
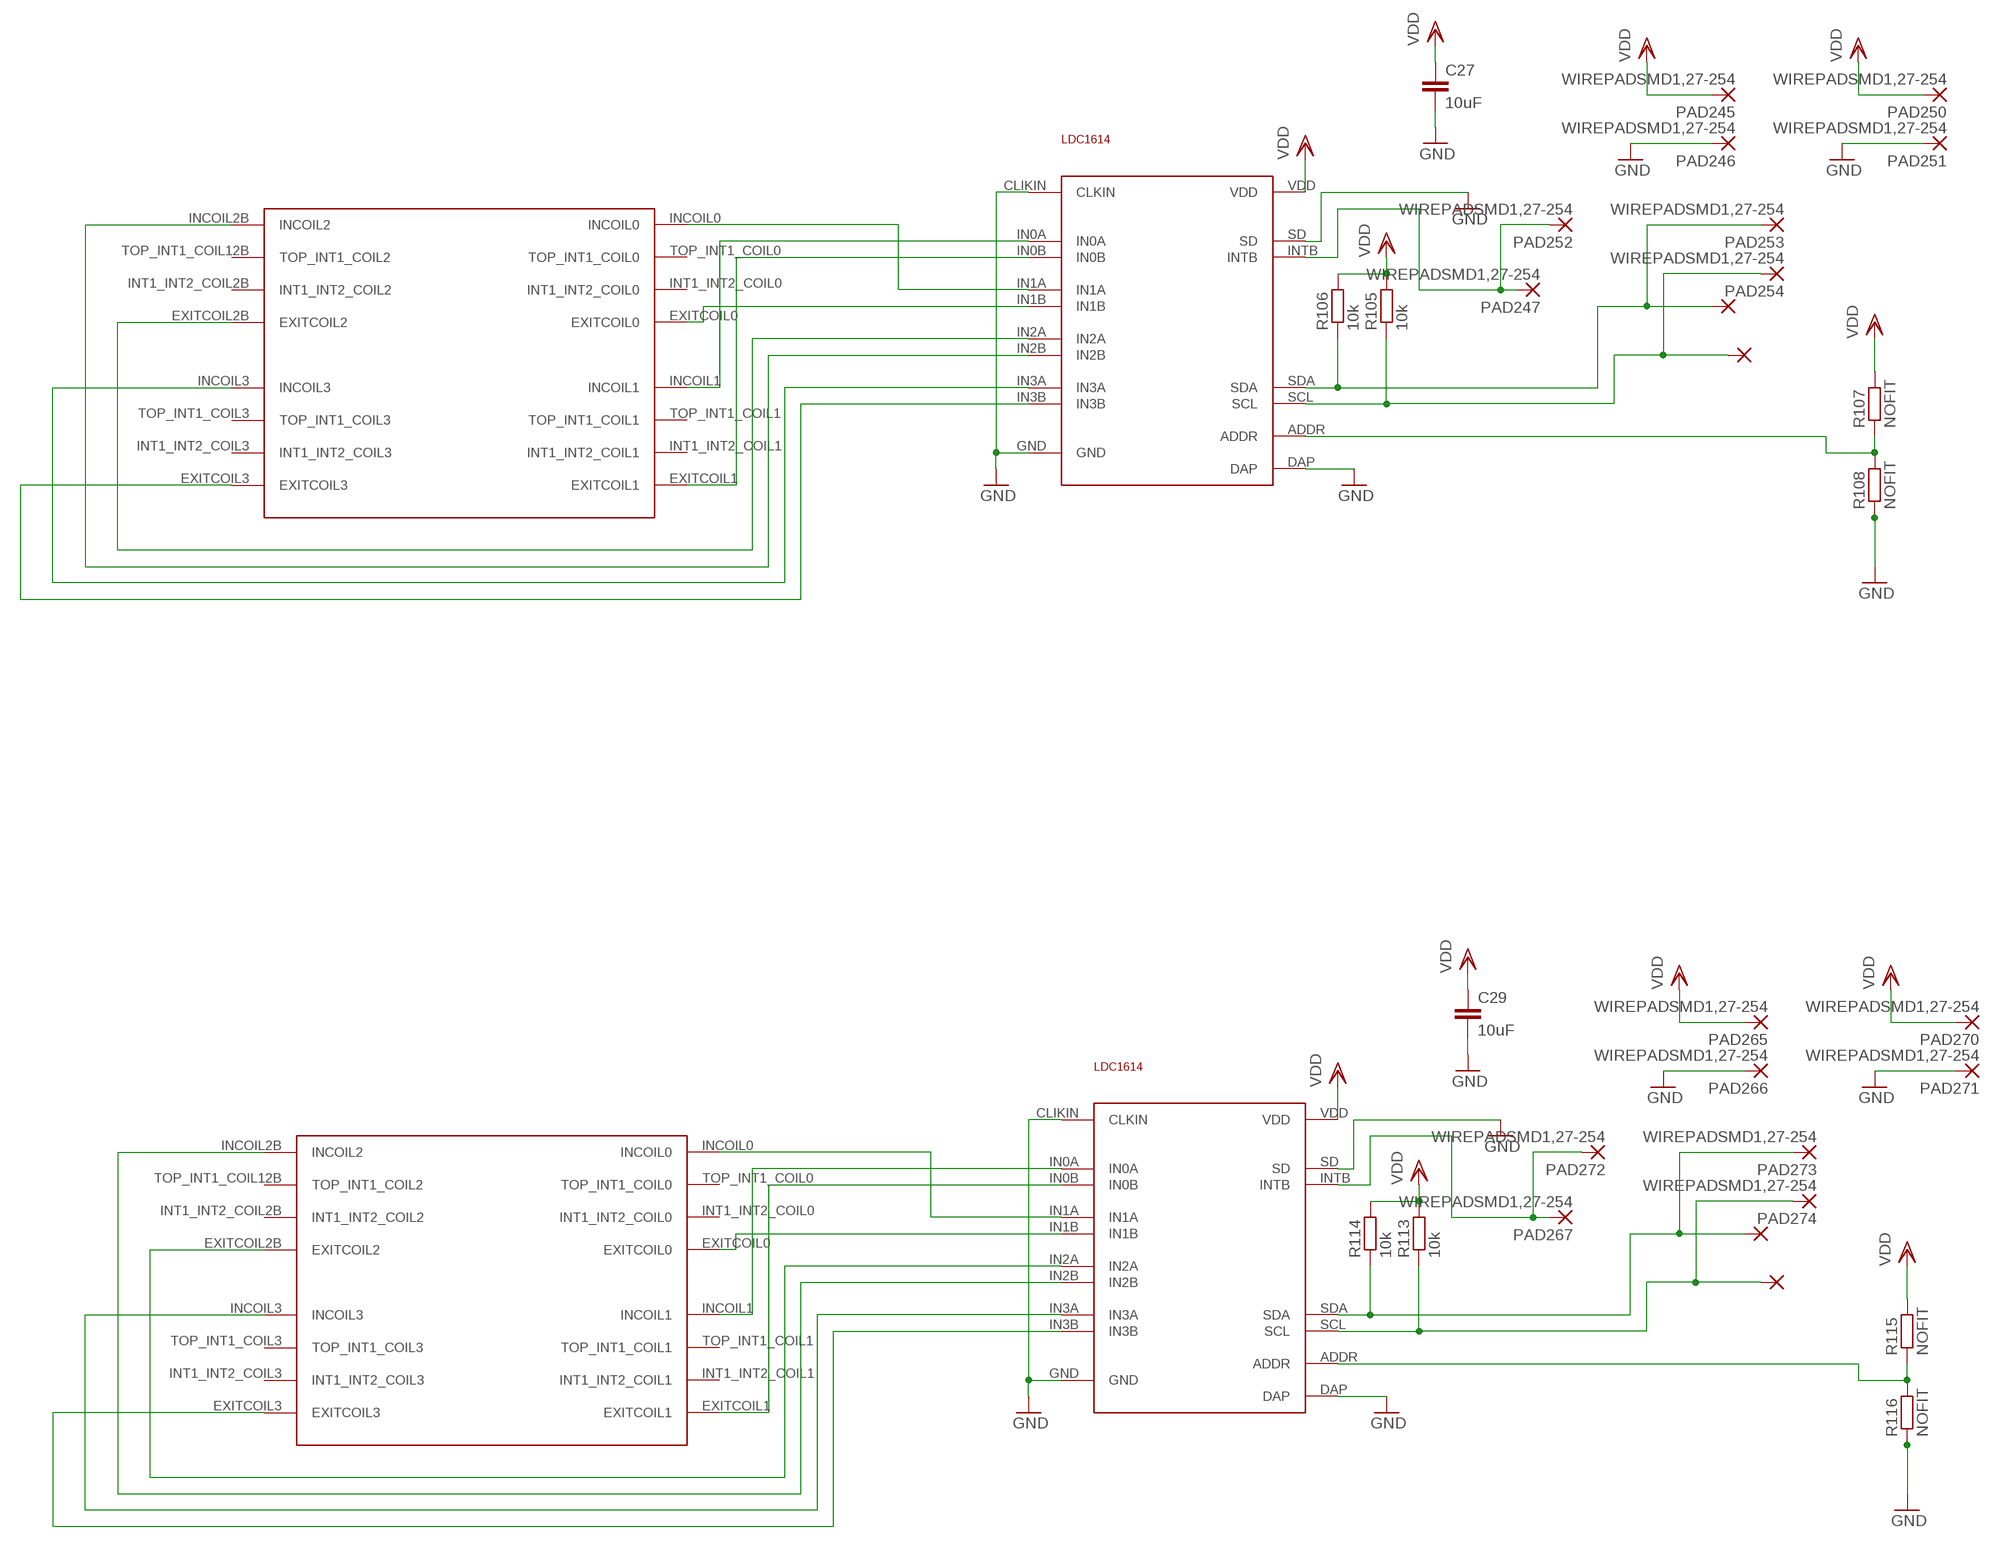
[diagram p6: schematic, sheet 2, part 3 of 4]
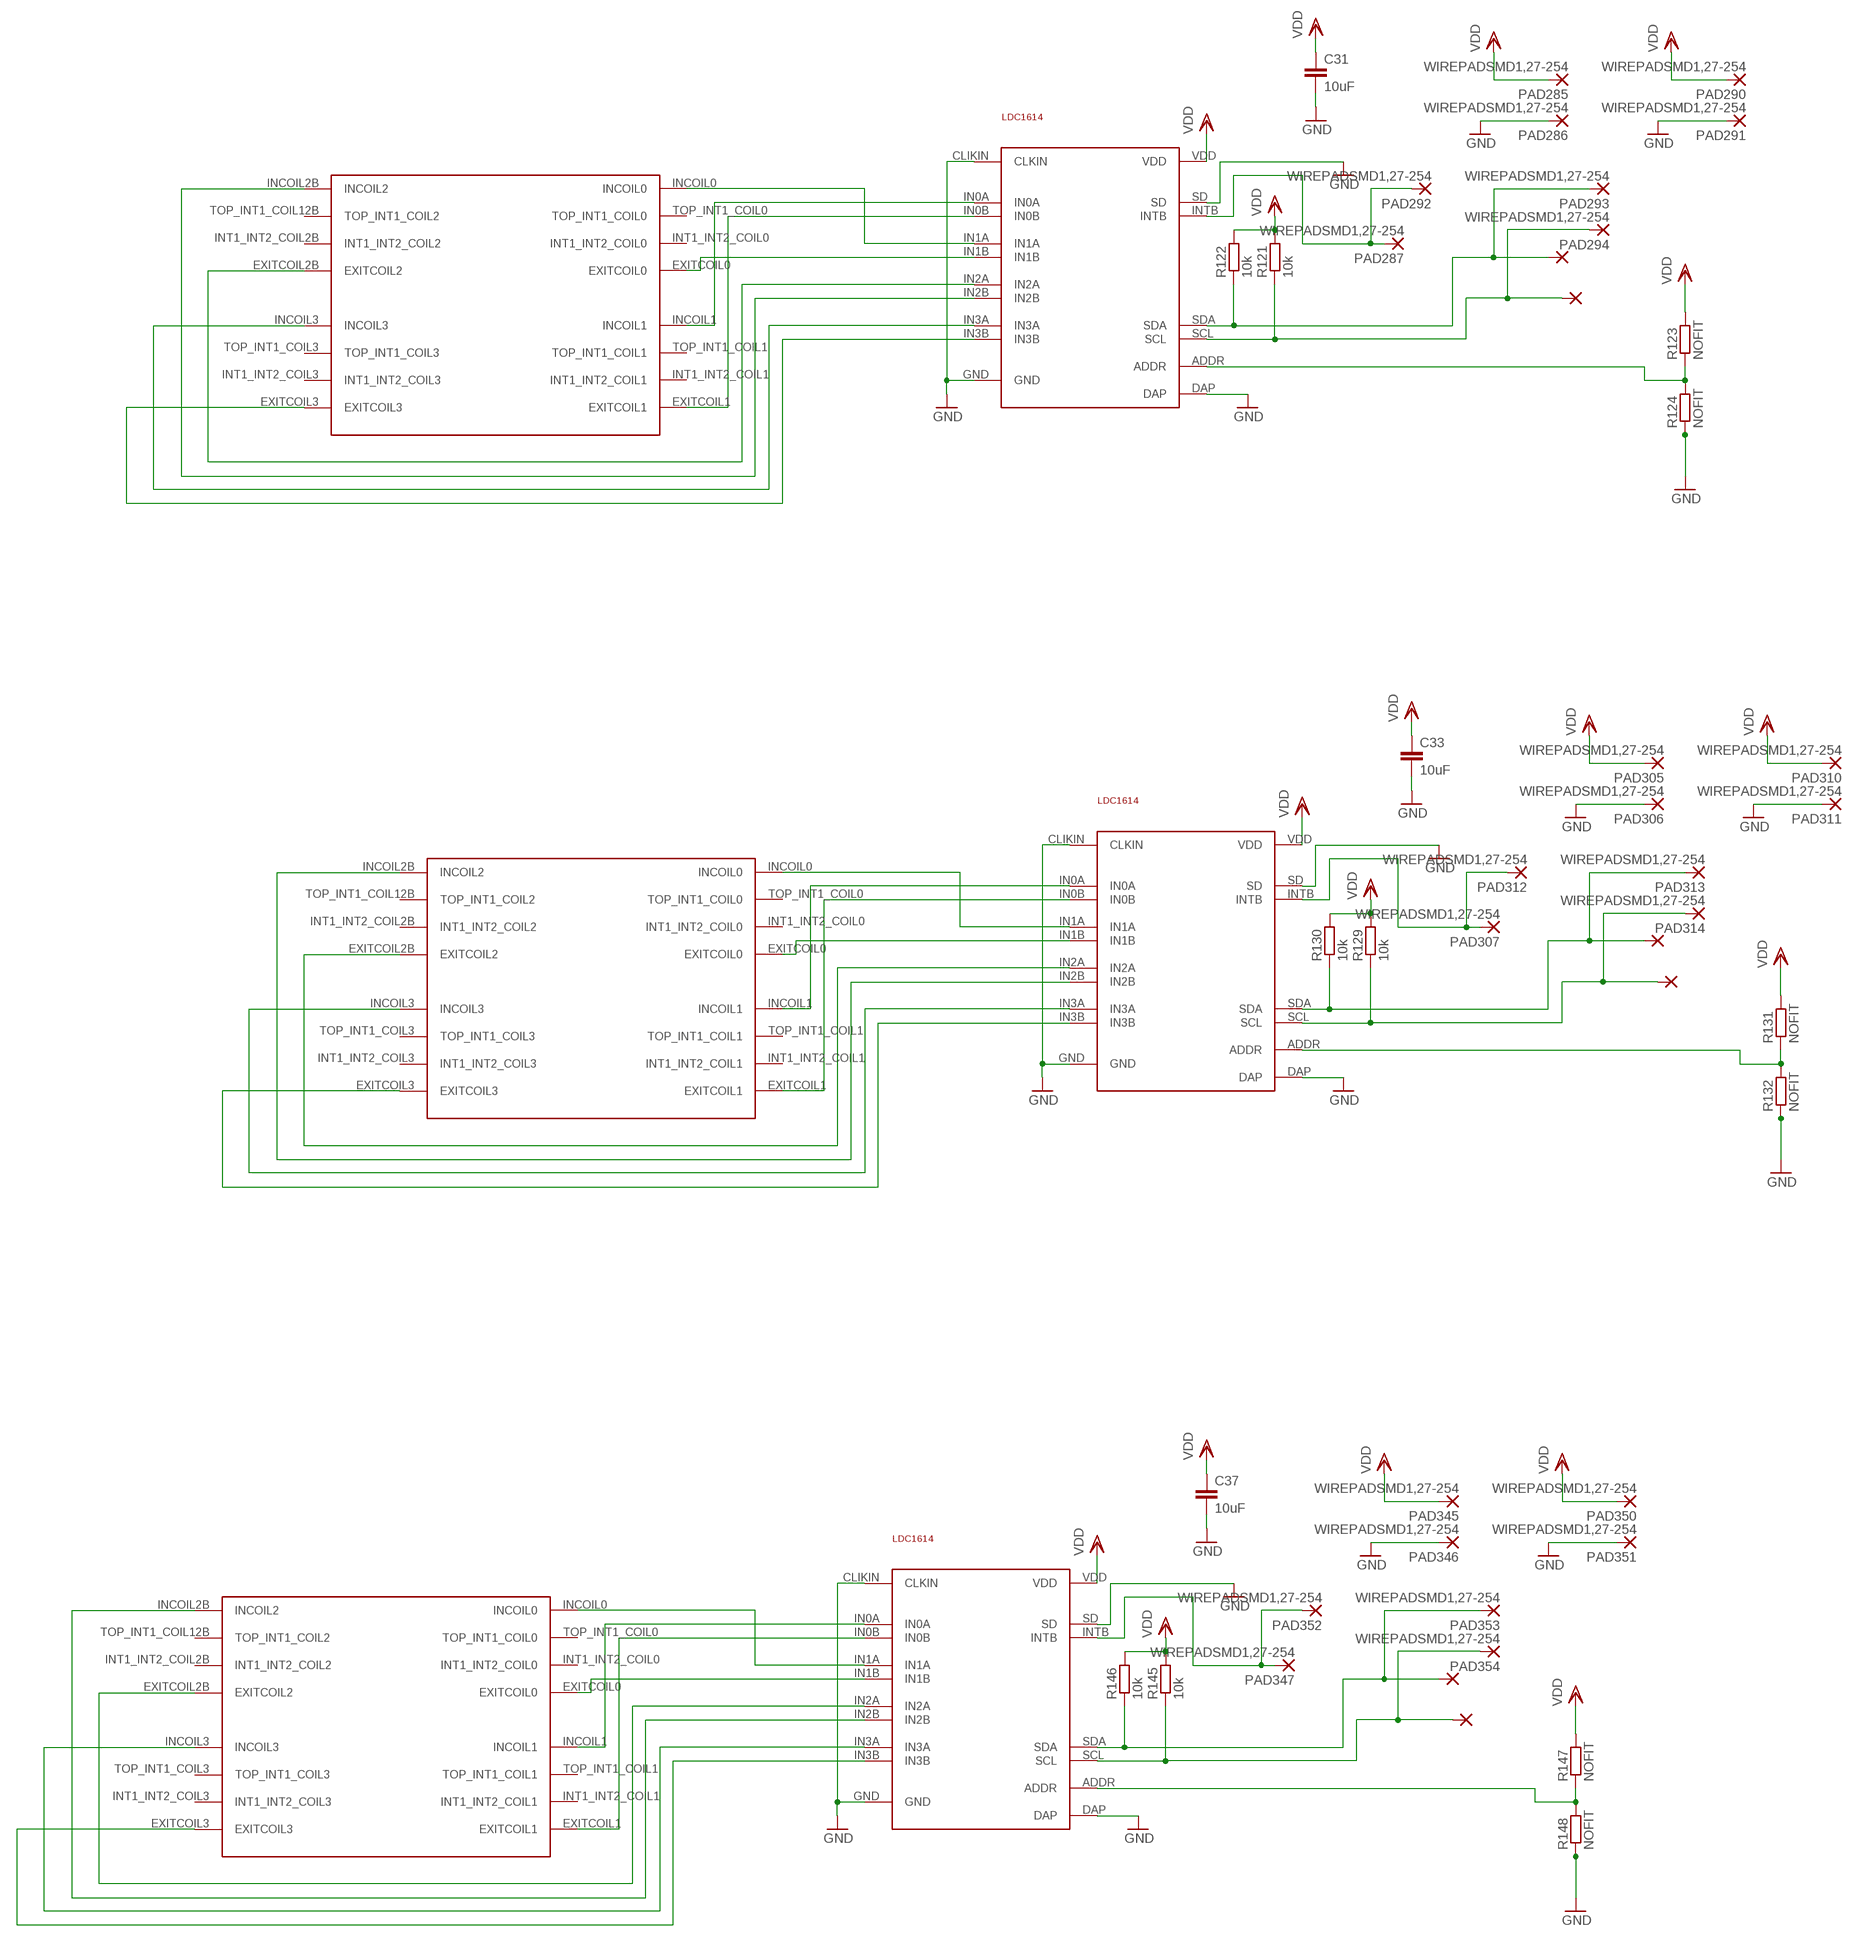
[diagram p7: schematic, sheet 2, part 4 of 4]

### Parts
C19  10uF  C-EUC0402  [C0402]
C21  10uF  C-EUC0402  [C0402]
C23  10uF  C-EUC0402  [C0402]
C25  10uF  C-EUC0402  [C0402]
C27  10uF  C-EUC0402  [C0402]
C29  10uF  C-EUC0402  [C0402]
C31  10uF  C-EUC0402  [C0402]
C33  10uF  C-EUC0402  [C0402]
C35  10uF  C-EUC0402  [C0402]
C37  10uF  C-EUC0402  [C0402]
PAD165  WIREPADSMD1,27-254  [SMD1,27-2,54]
PAD166  WIREPADSMD1,27-254  [SMD1,27-2,54]
PAD167  WIREPADSMD1,27-254  [SMD1,27-2,54]
PAD168  WIREPADSMD1,27-254  [SMD1,27-2,54]
PAD169  WIREPADSMD1,27-254  [SMD1,27-2,54]
PAD170  WIREPADSMD1,27-254  [SMD1,27-2,54]
PAD171  WIREPADSMD1,27-254  [SMD1,27-2,54]
PAD172  WIREPADSMD1,27-254  [SMD1,27-2,54]
PAD173  WIREPADSMD1,27-254  [SMD1,27-2,54]
PAD174  WIREPADSMD1,27-254  [SMD1,27-2,54]
PAD185  WIREPADSMD1,27-254  [SMD1,27-2,54]
PAD186  WIREPADSMD1,27-254  [SMD1,27-2,54]
PAD187  WIREPADSMD1,27-254  [SMD1,27-2,54]
PAD188  WIREPADSMD1,27-254  [SMD1,27-2,54]
PAD189  WIREPADSMD1,27-254  [SMD1,27-2,54]
PAD190  WIREPADSMD1,27-254  [SMD1,27-2,54]
PAD191  WIREPADSMD1,27-254  [SMD1,27-2,54]
PAD192  WIREPADSMD1,27-254  [SMD1,27-2,54]
PAD193  WIREPADSMD1,27-254  [SMD1,27-2,54]
PAD194  WIREPADSMD1,27-254  [SMD1,27-2,54]
PAD205  WIREPADSMD1,27-254  [SMD1,27-2,54]
PAD206  WIREPADSMD1,27-254  [SMD1,27-2,54]
PAD207  WIREPADSMD1,27-254  [SMD1,27-2,54]
PAD208  WIREPADSMD1,27-254  [SMD1,27-2,54]
PAD209  WIREPADSMD1,27-254  [SMD1,27-2,54]
PAD210  WIREPADSMD1,27-254  [SMD1,27-2,54]
PAD211  WIREPADSMD1,27-254  [SMD1,27-2,54]
PAD212  WIREPADSMD1,27-254  [SMD1,27-2,54]
PAD213  WIREPADSMD1,27-254  [SMD1,27-2,54]
PAD214  WIREPADSMD1,27-254  [SMD1,27-2,54]
PAD225  WIREPADSMD1,27-254  [SMD1,27-2,54]
PAD226  WIREPADSMD1,27-254  [SMD1,27-2,54]
PAD227  WIREPADSMD1,27-254  [SMD1,27-2,54]
PAD228  WIREPADSMD1,27-254  [SMD1,27-2,54]
PAD229  WIREPADSMD1,27-254  [SMD1,27-2,54]
PAD230  WIREPADSMD1,27-254  [SMD1,27-2,54]
PAD231  WIREPADSMD1,27-254  [SMD1,27-2,54]
PAD232  WIREPADSMD1,27-254  [SMD1,27-2,54]
PAD233  WIREPADSMD1,27-254  [SMD1,27-2,54]
PAD234  WIREPADSMD1,27-254  [SMD1,27-2,54]
PAD245  WIREPADSMD1,27-254  [SMD1,27-2,54]
PAD246  WIREPADSMD1,27-254  [SMD1,27-2,54]
PAD247  WIREPADSMD1,27-254  [SMD1,27-2,54]
PAD248  WIREPADSMD1,27-254  [SMD1,27-2,54]
PAD249  WIREPADSMD1,27-254  [SMD1,27-2,54]
PAD250  WIREPADSMD1,27-254  [SMD1,27-2,54]
PAD251  WIREPADSMD1,27-254  [SMD1,27-2,54]
PAD252  WIREPADSMD1,27-254  [SMD1,27-2,54]
PAD253  WIREPADSMD1,27-254  [SMD1,27-2,54]
PAD254  WIREPADSMD1,27-254  [SMD1,27-2,54]
PAD265  WIREPADSMD1,27-254  [SMD1,27-2,54]
PAD266  WIREPADSMD1,27-254  [SMD1,27-2,54]
PAD267  WIREPADSMD1,27-254  [SMD1,27-2,54]
PAD268  WIREPADSMD1,27-254  [SMD1,27-2,54]
PAD269  WIREPADSMD1,27-254  [SMD1,27-2,54]
PAD270  WIREPADSMD1,27-254  [SMD1,27-2,54]
PAD271  WIREPADSMD1,27-254  [SMD1,27-2,54]
PAD272  WIREPADSMD1,27-254  [SMD1,27-2,54]
PAD273  WIREPADSMD1,27-254  [SMD1,27-2,54]
PAD274  WIREPADSMD1,27-254  [SMD1,27-2,54]
PAD285  WIREPADSMD1,27-254  [SMD1,27-2,54]
PAD286  WIREPADSMD1,27-254  [SMD1,27-2,54]
PAD287  WIREPADSMD1,27-254  [SMD1,27-2,54]
PAD288  WIREPADSMD1,27-254  [SMD1,27-2,54]
PAD289  WIREPADSMD1,27-254  [SMD1,27-2,54]
PAD290  WIREPADSMD1,27-254  [SMD1,27-2,54]
PAD291  WIREPADSMD1,27-254  [SMD1,27-2,54]
PAD292  WIREPADSMD1,27-254  [SMD1,27-2,54]
PAD293  WIREPADSMD1,27-254  [SMD1,27-2,54]
PAD294  WIREPADSMD1,27-254  [SMD1,27-2,54]
PAD305  WIREPADSMD1,27-254  [SMD1,27-2,54]
PAD306  WIREPADSMD1,27-254  [SMD1,27-2,54]
PAD307  WIREPADSMD1,27-254  [SMD1,27-2,54]
PAD308  WIREPADSMD1,27-254  [SMD1,27-2,54]
PAD309  WIREPADSMD1,27-254  [SMD1,27-2,54]
PAD310  WIREPADSMD1,27-254  [SMD1,27-2,54]
PAD311  WIREPADSMD1,27-254  [SMD1,27-2,54]
PAD312  WIREPADSMD1,27-254  [SMD1,27-2,54]
PAD313  WIREPADSMD1,27-254  [SMD1,27-2,54]
PAD314  WIREPADSMD1,27-254  [SMD1,27-2,54]
PAD325  WIREPADSMD1,27-254  [SMD1,27-2,54]
PAD326  WIREPADSMD1,27-254  [SMD1,27-2,54]
PAD327  WIREPADSMD1,27-254  [SMD1,27-2,54]
PAD328  WIREPADSMD1,27-254  [SMD1,27-2,54]
PAD329  WIREPADSMD1,27-254  [SMD1,27-2,54]
PAD330  WIREPADSMD1,27-254  [SMD1,27-2,54]
PAD331  WIREPADSMD1,27-254  [SMD1,27-2,54]
PAD332  WIREPADSMD1,27-254  [SMD1,27-2,54]
PAD333  WIREPADSMD1,27-254  [SMD1,27-2,54]
PAD334  WIREPADSMD1,27-254  [SMD1,27-2,54]
PAD345  WIREPADSMD1,27-254  [SMD1,27-2,54]
PAD346  WIREPADSMD1,27-254  [SMD1,27-2,54]
PAD347  WIREPADSMD1,27-254  [SMD1,27-2,54]
PAD348  WIREPADSMD1,27-254  [SMD1,27-2,54]
PAD349  WIREPADSMD1,27-254  [SMD1,27-2,54]
PAD350  WIREPADSMD1,27-254  [SMD1,27-2,54]
PAD351  WIREPADSMD1,27-254  [SMD1,27-2,54]
PAD352  WIREPADSMD1,27-254  [SMD1,27-2,54]
PAD353  WIREPADSMD1,27-254  [SMD1,27-2,54]
PAD354  WIREPADSMD1,27-254  [SMD1,27-2,54]
R73  10k  R-EU_R0402  [R0402]
R74  10k  R-EU_R0402  [R0402]
R75  NOFIT  R-EU_R0201  [R0201]
R76  NOFIT  R-EU_R0201  [R0201]
R81  10k  R-EU_R0402  [R0402]
R82  10k  R-EU_R0402  [R0402]
R83  NOFIT  R-EU_R0201  [R0201]
R84  NOFIT  R-EU_R0201  [R0201]
R89  10k  R-EU_R0402  [R0402]
R90  10k  R-EU_R0402  [R0402]
R91  NOFIT  R-EU_R0201  [R0201]
R92  NOFIT  R-EU_R0201  [R0201]
R97  10k  R-EU_R0402  [R0402]
R98  10k  R-EU_R0402  [R0402]
R99  NOFIT  R-EU_R0201  [R0201]
R100  NOFIT  R-EU_R0201  [R0201]
R105  10k  R-EU_R0402  [R0402]
R106  10k  R-EU_R0402  [R0402]
R107  NOFIT  R-EU_R0201  [R0201]
R108  NOFIT  R-EU_R0201  [R0201]
R113  10k  R-EU_R0402  [R0402]
R114  10k  R-EU_R0402  [R0402]
R115  NOFIT  R-EU_R0201  [R0201]
R116  NOFIT  R-EU_R0201  [R0201]
R121  10k  R-EU_R0402  [R0402]
R122  10k  R-EU_R0402  [R0402]
R123  NOFIT  R-EU_R0201  [R0201]
R124  NOFIT  R-EU_R0201  [R0201]
R129  10k  R-EU_R0402  [R0402]
R130  10k  R-EU_R0402  [R0402]
R131  NOFIT  R-EU_R0201  [R0201]
R132  NOFIT  R-EU_R0201  [R0201]
R137  10k  R-EU_R0402  [R0402]
R138  10k  R-EU_R0402  [R0402]
R139  NOFIT  R-EU_R0201  [R0201]
R140  NOFIT  R-EU_R0201  [R0201]
R145  10k  R-EU_R0402  [R0402]
R146  10k  R-EU_R0402  [R0402]
R147  NOFIT  R-EU_R0201  [R0201]
R148  NOFIT  R-EU_R0201  [R0201]
U19  LDC1614  [WQFN-16]
U21  LDC1614  [WQFN-16]
U23  LDC1614  [WQFN-16]
U25  LDC1614  [WQFN-16]
U27  LDC1614  [WQFN-16]
U29  LDC1614  [WQFN-16]
U31  LDC1614  [WQFN-16]
U33  LDC1614  [WQFN-16]
U35  LDC1614  [WQFN-16]
U37  LDC1614  [WQFN-16]
U$19  FATFAN_GROUP  [FAT_FAN]
U$21  FATFAN_GROUP  [FAT_FAN]
U$23  FATFAN_GROUP  [FAT_FAN]
U$25  FATFAN_GROUP  [FAT_FAN]
U$27  FATFAN_GROUP  [FAT_FAN]
U$29  FATFAN_GROUP  [FAT_FAN]
U$31  FATFAN_GROUP  [FAT_FAN]
U$33  FATFAN_GROUP  [FAT_FAN]
U$35  FATFAN_GROUP  [FAT_FAN]
U$37  FATFAN_GROUP  [FAT_FAN]

### Nets
ADDR18: R75.1 R76.2 U19.ADDR
ADDR20: R83.1 R84.2 U21.ADDR
ADDR22: R91.1 R92.2 U23.ADDR
ADDR24: R99.1 R100.2 U25.ADDR
ADDR26: R107.1 R108.2 U27.ADDR
ADDR28: R115.1 R116.2 U29.ADDR
ADDR30: R123.1 R124.2 U31.ADDR
ADDR32: R131.1 R132.2 U33.ADDR
ADDR34: R139.1 R140.2 U35.ADDR
ADDR36: R147.1 R148.2 U37.ADDR
GND: C19.2 C21.2 C23.2 C25.2 C27.2 C29.2 C31.2 C33.2 C35.2 C37.2 PAD166.1(P) PAD171.1(P) PAD186.1(P) PAD191.1(P) PAD206.1(P) PAD211.1(P) PAD226.1(P) PAD231.1(P) PAD246.1(P) PAD251.1(P) PAD266.1(P) PAD271.1(P) PAD286.1(P) PAD291.1(P) PAD306.1(P) PAD311.1(P) PAD326.1(P) PAD331.1(P) PAD346.1(P) PAD351.1(P) R76.1 R84.1 R92.1 R100.1 R108.1 R116.1 R124.1 R132.1 R140.1 R148.1 U19.CLIKIN(CLKIN) U19.DAP U19.GND U19.SD U21.CLIKIN(CLKIN) U21.DAP U21.GND U21.SD U23.CLIKIN(CLKIN) U23.DAP U23.GND U23.SD U25.CLIKIN(CLKIN) U25.DAP U25.GND U25.SD U27.CLIKIN(CLKIN) U27.DAP U27.GND U27.SD U29.CLIKIN(CLKIN) U29.DAP U29.GND U29.SD U31.CLIKIN(CLKIN) U31.DAP U31.GND U31.SD U33.CLIKIN(CLKIN) U33.DAP U33.GND U33.SD U35.CLIKIN(CLKIN) U35.DAP U35.GND U35.SD U37.CLIKIN(CLKIN) U37.DAP U37.GND U37.SD ; also sheet 1
INTRPT18: PAD167.1(P) PAD172.1(P) U19.INTB
INTRPT20: PAD187.1(P) PAD192.1(P) U21.INTB
INTRPT22: PAD207.1(P) PAD212.1(P) U23.INTB
INTRPT24: PAD227.1(P) PAD232.1(P) U25.INTB
INTRPT26: PAD247.1(P) PAD252.1(P) U27.INTB
INTRPT28: PAD267.1(P) PAD272.1(P) U29.INTB
INTRPT30: PAD287.1(P) PAD292.1(P) U31.INTB
INTRPT32: PAD307.1(P) PAD312.1(P) U33.INTB
INTRPT34: PAD327.1(P) PAD332.1(P) U35.INTB
INTRPT36: PAD347.1(P) PAD352.1(P) U37.INTB
N$145: U19.IN1B U$19.EXITCOIL0
N$146: U19.IN0A U$19.INCOIL1
N$147: U19.IN0B U$19.EXITCOIL1
N$148: U19.IN2A U$19.EXITCOIL2B(EXITCOIL2)
N$149: U19.IN2B U$19.INCOIL2B(INCOIL2)
N$150: U19.IN3A U$19.INCOIL3
N$151: U19.IN3B U$19.EXITCOIL3
N$152: U19.IN1A U$19.INCOIL0
N$161: U21.IN1B U$21.EXITCOIL0
N$162: U21.IN0A U$21.INCOIL1
N$163: U21.IN0B U$21.EXITCOIL1
N$164: U21.IN2A U$21.EXITCOIL2B(EXITCOIL2)
N$165: U21.IN2B U$21.INCOIL2B(INCOIL2)
N$166: U21.IN3A U$21.INCOIL3
N$167: U21.IN3B U$21.EXITCOIL3
N$168: U21.IN1A U$21.INCOIL0
N$177: U23.IN1B U$23.EXITCOIL0
N$178: U23.IN0A U$23.INCOIL1
N$179: U23.IN0B U$23.EXITCOIL1
N$180: U23.IN2A U$23.EXITCOIL2B(EXITCOIL2)
N$181: U23.IN2B U$23.INCOIL2B(INCOIL2)
N$182: U23.IN3A U$23.INCOIL3
N$183: U23.IN3B U$23.EXITCOIL3
N$184: U23.IN1A U$23.INCOIL0
N$193: U25.IN1B U$25.EXITCOIL0
N$194: U25.IN0A U$25.INCOIL1
N$195: U25.IN0B U$25.EXITCOIL1
N$196: U25.IN2A U$25.EXITCOIL2B(EXITCOIL2)
N$197: U25.IN2B U$25.INCOIL2B(INCOIL2)
N$198: U25.IN3A U$25.INCOIL3
N$199: U25.IN3B U$25.EXITCOIL3
N$200: U25.IN1A U$25.INCOIL0
N$209: U27.IN1B U$27.EXITCOIL0
N$210: U27.IN0A U$27.INCOIL1
N$211: U27.IN0B U$27.EXITCOIL1
N$212: U27.IN2A U$27.EXITCOIL2B(EXITCOIL2)
N$213: U27.IN2B U$27.INCOIL2B(INCOIL2)
N$214: U27.IN3A U$27.INCOIL3
N$215: U27.IN3B U$27.EXITCOIL3
N$216: U27.IN1A U$27.INCOIL0
N$225: U29.IN1B U$29.EXITCOIL0
N$226: U29.IN0A U$29.INCOIL1
N$227: U29.IN0B U$29.EXITCOIL1
N$228: U29.IN2A U$29.EXITCOIL2B(EXITCOIL2)
N$229: U29.IN2B U$29.INCOIL2B(INCOIL2)
N$230: U29.IN3A U$29.INCOIL3
N$231: U29.IN3B U$29.EXITCOIL3
N$232: U29.IN1A U$29.INCOIL0
N$241: U31.IN1B U$31.EXITCOIL0
N$242: U31.IN0A U$31.INCOIL1
N$243: U31.IN0B U$31.EXITCOIL1
N$244: U31.IN2A U$31.EXITCOIL2B(EXITCOIL2)
N$245: U31.IN2B U$31.INCOIL2B(INCOIL2)
N$246: U31.IN3A U$31.INCOIL3
N$247: U31.IN3B U$31.EXITCOIL3
N$248: U31.IN1A U$31.INCOIL0
N$257: U33.IN1B U$33.EXITCOIL0
N$258: U33.IN0A U$33.INCOIL1
N$259: U33.IN0B U$33.EXITCOIL1
N$260: U33.IN2A U$33.EXITCOIL2B(EXITCOIL2)
N$261: U33.IN2B U$33.INCOIL2B(INCOIL2)
N$262: U33.IN3A U$33.INCOIL3
N$263: U33.IN3B U$33.EXITCOIL3
N$264: U33.IN1A U$33.INCOIL0
N$273: U35.IN1B U$35.EXITCOIL0
N$274: U35.IN0A U$35.INCOIL1
N$275: U35.IN0B U$35.EXITCOIL1
N$276: U35.IN2A U$35.EXITCOIL2B(EXITCOIL2)
N$277: U35.IN2B U$35.INCOIL2B(INCOIL2)
N$278: U35.IN3A U$35.INCOIL3
N$279: U35.IN3B U$35.EXITCOIL3
N$280: U35.IN1A U$35.INCOIL0
N$289: U37.IN1B U$37.EXITCOIL0
N$290: U37.IN0A U$37.INCOIL1
N$291: U37.IN0B U$37.EXITCOIL1
N$292: U37.IN2A U$37.EXITCOIL2B(EXITCOIL2)
N$293: U37.IN2B U$37.INCOIL2B(INCOIL2)
N$294: U37.IN3A U$37.INCOIL3
N$295: U37.IN3B U$37.EXITCOIL3
N$296: U37.IN1A U$37.INCOIL0
SCL18: PAD169.1(P) PAD174.1(P) R73.1 U19.SCL
SCL20: PAD189.1(P) PAD194.1(P) R81.1 U21.SCL
SCL22: PAD209.1(P) PAD214.1(P) R89.1 U23.SCL
SCL24: PAD229.1(P) PAD234.1(P) R97.1 U25.SCL
SCL26: PAD249.1(P) PAD254.1(P) R105.1 U27.SCL
SCL28: PAD269.1(P) PAD274.1(P) R113.1 U29.SCL
SCL30: PAD289.1(P) PAD294.1(P) R121.1 U31.SCL
SCL32: PAD309.1(P) PAD314.1(P) R129.1 U33.SCL
SCL34: PAD329.1(P) PAD334.1(P) R137.1 U35.SCL
SCL36: PAD349.1(P) PAD354.1(P) R145.1 U37.SCL
SDA18: PAD168.1(P) PAD173.1(P) R74.1 U19.SDA
SDA20: PAD188.1(P) PAD193.1(P) R82.1 U21.SDA
SDA22: PAD208.1(P) PAD213.1(P) R90.1 U23.SDA
SDA24: PAD228.1(P) PAD233.1(P) R98.1 U25.SDA
SDA26: PAD248.1(P) PAD253.1(P) R106.1 U27.SDA
SDA28: PAD268.1(P) PAD273.1(P) R114.1 U29.SDA
SDA30: PAD288.1(P) PAD293.1(P) R122.1 U31.SDA
SDA32: PAD308.1(P) PAD313.1(P) R130.1 U33.SDA
SDA34: PAD328.1(P) PAD333.1(P) R138.1 U35.SDA
SDA36: PAD348.1(P) PAD353.1(P) R146.1 U37.SDA
VDD: C19.1 C21.1 C23.1 C25.1 C27.1 C29.1 C31.1 C33.1 C35.1 C37.1 PAD165.1(P) PAD170.1(P) PAD185.1(P) PAD190.1(P) PAD205.1(P) PAD210.1(P) PAD225.1(P) PAD230.1(P) PAD245.1(P) PAD250.1(P) PAD265.1(P) PAD270.1(P) PAD285.1(P) PAD290.1(P) PAD305.1(P) PAD310.1(P) PAD325.1(P) PAD330.1(P) PAD345.1(P) PAD350.1(P) R73.2 R74.2 R75.2 R81.2 R82.2 R83.2 R89.2 R90.2 R91.2 R97.2 R98.2 R99.2 R105.2 R106.2 R107.2 R113.2 R114.2 R115.2 R121.2 R122.2 R123.2 R129.2 R130.2 R131.2 R137.2 R138.2 R139.2 R145.2 R146.2 R147.2 U19.VDD U21.VDD U23.VDD U25.VDD U27.VDD U29.VDD U31.VDD U33.VDD U35.VDD U37.VDD ; also sheet 1
Unconnected: U$19.INT1_INT2_COIL0 U$19.INT1_INT2_COIL1 U$19.INT1_INT2_COIL2B(INT1_INT2_COIL2) U$19.INT1_INT2_COIL3 U$19.TOP_INT1_COIL0 U$19.TOP_INT1_COIL1 U$19.TOP_INT1_COIL3 U$19.TOP_INT1_COIL12B(TOP_INT1_COIL2) U$21.INT1_INT2_COIL0 U$21.INT1_INT2_COIL1 U$21.INT1_INT2_COIL2B(INT1_INT2_COIL2) U$21.INT1_INT2_COIL3 U$21.TOP_INT1_COIL0 U$21.TOP_INT1_COIL1 U$21.TOP_INT1_COIL3 U$21.TOP_INT1_COIL12B(TOP_INT1_COIL2) U$23.INT1_INT2_COIL0 U$23.INT1_INT2_COIL1 U$23.INT1_INT2_COIL2B(INT1_INT2_COIL2) U$23.INT1_INT2_COIL3 U$23.TOP_INT1_COIL0 U$23.TOP_INT1_COIL1 U$23.TOP_INT1_COIL3 U$23.TOP_INT1_COIL12B(TOP_INT1_COIL2) U$25.INT1_INT2_COIL0 U$25.INT1_INT2_COIL1 U$25.INT1_INT2_COIL2B(INT1_INT2_COIL2) U$25.INT1_INT2_COIL3 U$25.TOP_INT1_COIL0 U$25.TOP_INT1_COIL1 U$25.TOP_INT1_COIL3 U$25.TOP_INT1_COIL12B(TOP_INT1_COIL2) U$27.INT1_INT2_COIL0 U$27.INT1_INT2_COIL1 U$27.INT1_INT2_COIL2B(INT1_INT2_COIL2) U$27.INT1_INT2_COIL3 U$27.TOP_INT1_COIL0 U$27.TOP_INT1_COIL1 U$27.TOP_INT1_COIL3 U$27.TOP_INT1_COIL12B(TOP_INT1_COIL2) U$29.INT1_INT2_COIL0 U$29.INT1_INT2_COIL1 U$29.INT1_INT2_COIL2B(INT1_INT2_COIL2) U$29.INT1_INT2_COIL3 U$29.TOP_INT1_COIL0 U$29.TOP_INT1_COIL1 U$29.TOP_INT1_COIL3 U$29.TOP_INT1_COIL12B(TOP_INT1_COIL2) U$31.INT1_INT2_COIL0 U$31.INT1_INT2_COIL1 U$31.INT1_INT2_COIL2B(INT1_INT2_COIL2) U$31.INT1_INT2_COIL3 U$31.TOP_INT1_COIL0 U$31.TOP_INT1_COIL1 U$31.TOP_INT1_COIL3 U$31.TOP_INT1_COIL12B(TOP_INT1_COIL2) U$33.INT1_INT2_COIL0 U$33.INT1_INT2_COIL1 U$33.INT1_INT2_COIL2B(INT1_INT2_COIL2) U$33.INT1_INT2_COIL3 U$33.TOP_INT1_COIL0 U$33.TOP_INT1_COIL1 U$33.TOP_INT1_COIL3 U$33.TOP_INT1_COIL12B(TOP_INT1_COIL2) U$35.INT1_INT2_COIL0 U$35.INT1_INT2_COIL1 U$35.INT1_INT2_COIL2B(INT1_INT2_COIL2) U$35.INT1_INT2_COIL3 U$35.TOP_INT1_COIL0 U$35.TOP_INT1_COIL1 U$35.TOP_INT1_COIL3 U$35.TOP_INT1_COIL12B(TOP_INT1_COIL2) U$37.INT1_INT2_COIL0 U$37.INT1_INT2_COIL1 U$37.INT1_INT2_COIL2B(INT1_INT2_COIL2) U$37.INT1_INT2_COIL3 U$37.TOP_INT1_COIL0 U$37.TOP_INT1_COIL1 U$37.TOP_INT1_COIL3 U$37.TOP_INT1_COIL12B(TOP_INT1_COIL2)

## Library data of the parts
C2 C4-C6 C8-C10 C12 C14 C16 C19 C21 C23 C25 C27 C29 C31 C33 C35 C37 = resistor:C-EU: CAPACITOR, European symbol
PAD8 PAD11-PAD18 PAD28-PAD54 PAD64-PAD90 PAD100-PAD108 PAD118-PAD126 PAD136-PAD144 PAD165-PAD174 PAD185-PAD194 PAD205-PAD214 PAD225-PAD234 PAD245-PAD254 PAD265-PAD274 PAD285-PAD294 PAD305-PAD314 PAD325-PAD334 PAD345-PAD354 = wirepad:WIREPAD: Wire PAD connect wire on PCB
R5-R8 R13-R24 R29-R40 R45-R48 R53-R56 R61-R64 R73-R76 R81-R84 R89-R92 R97-R100 R105-R108 R113-R116 R121-R124 R129-R132 R137-R140 R145-R148 = resistor:R-EU_: RESISTOR, European symbol
U2 U4-U6 U8-U10 U12 U14 U16 U19 U21 U23 U25 U27 U29 U31 U33 U35 U37 = LDC1614:LDC1614
U$1 U$4-U$6 U$8-U$10 U$12 U$14 U$16 = coils:FATSQUARE_GROUP
U$19 U$21 U$23 U$25 U$27 U$29 U$31 U$33 U$35 U$37 = coils:FATFAN_GROUP